# Altium project EVK-IRIS-W1-Mikro-Bus.PrjPcb (part 3 of 5)

## Sheet EVK-IRIS-W1_MikroBuses.SchDoc: Top Level Design
size A3; CompanyName: Rigado, LLC; Organization: Rigado; DocumentNumber: 10; SheetNumber: 10; SheetTotal: 14; Website: www.rigado.com; SheetSize: B
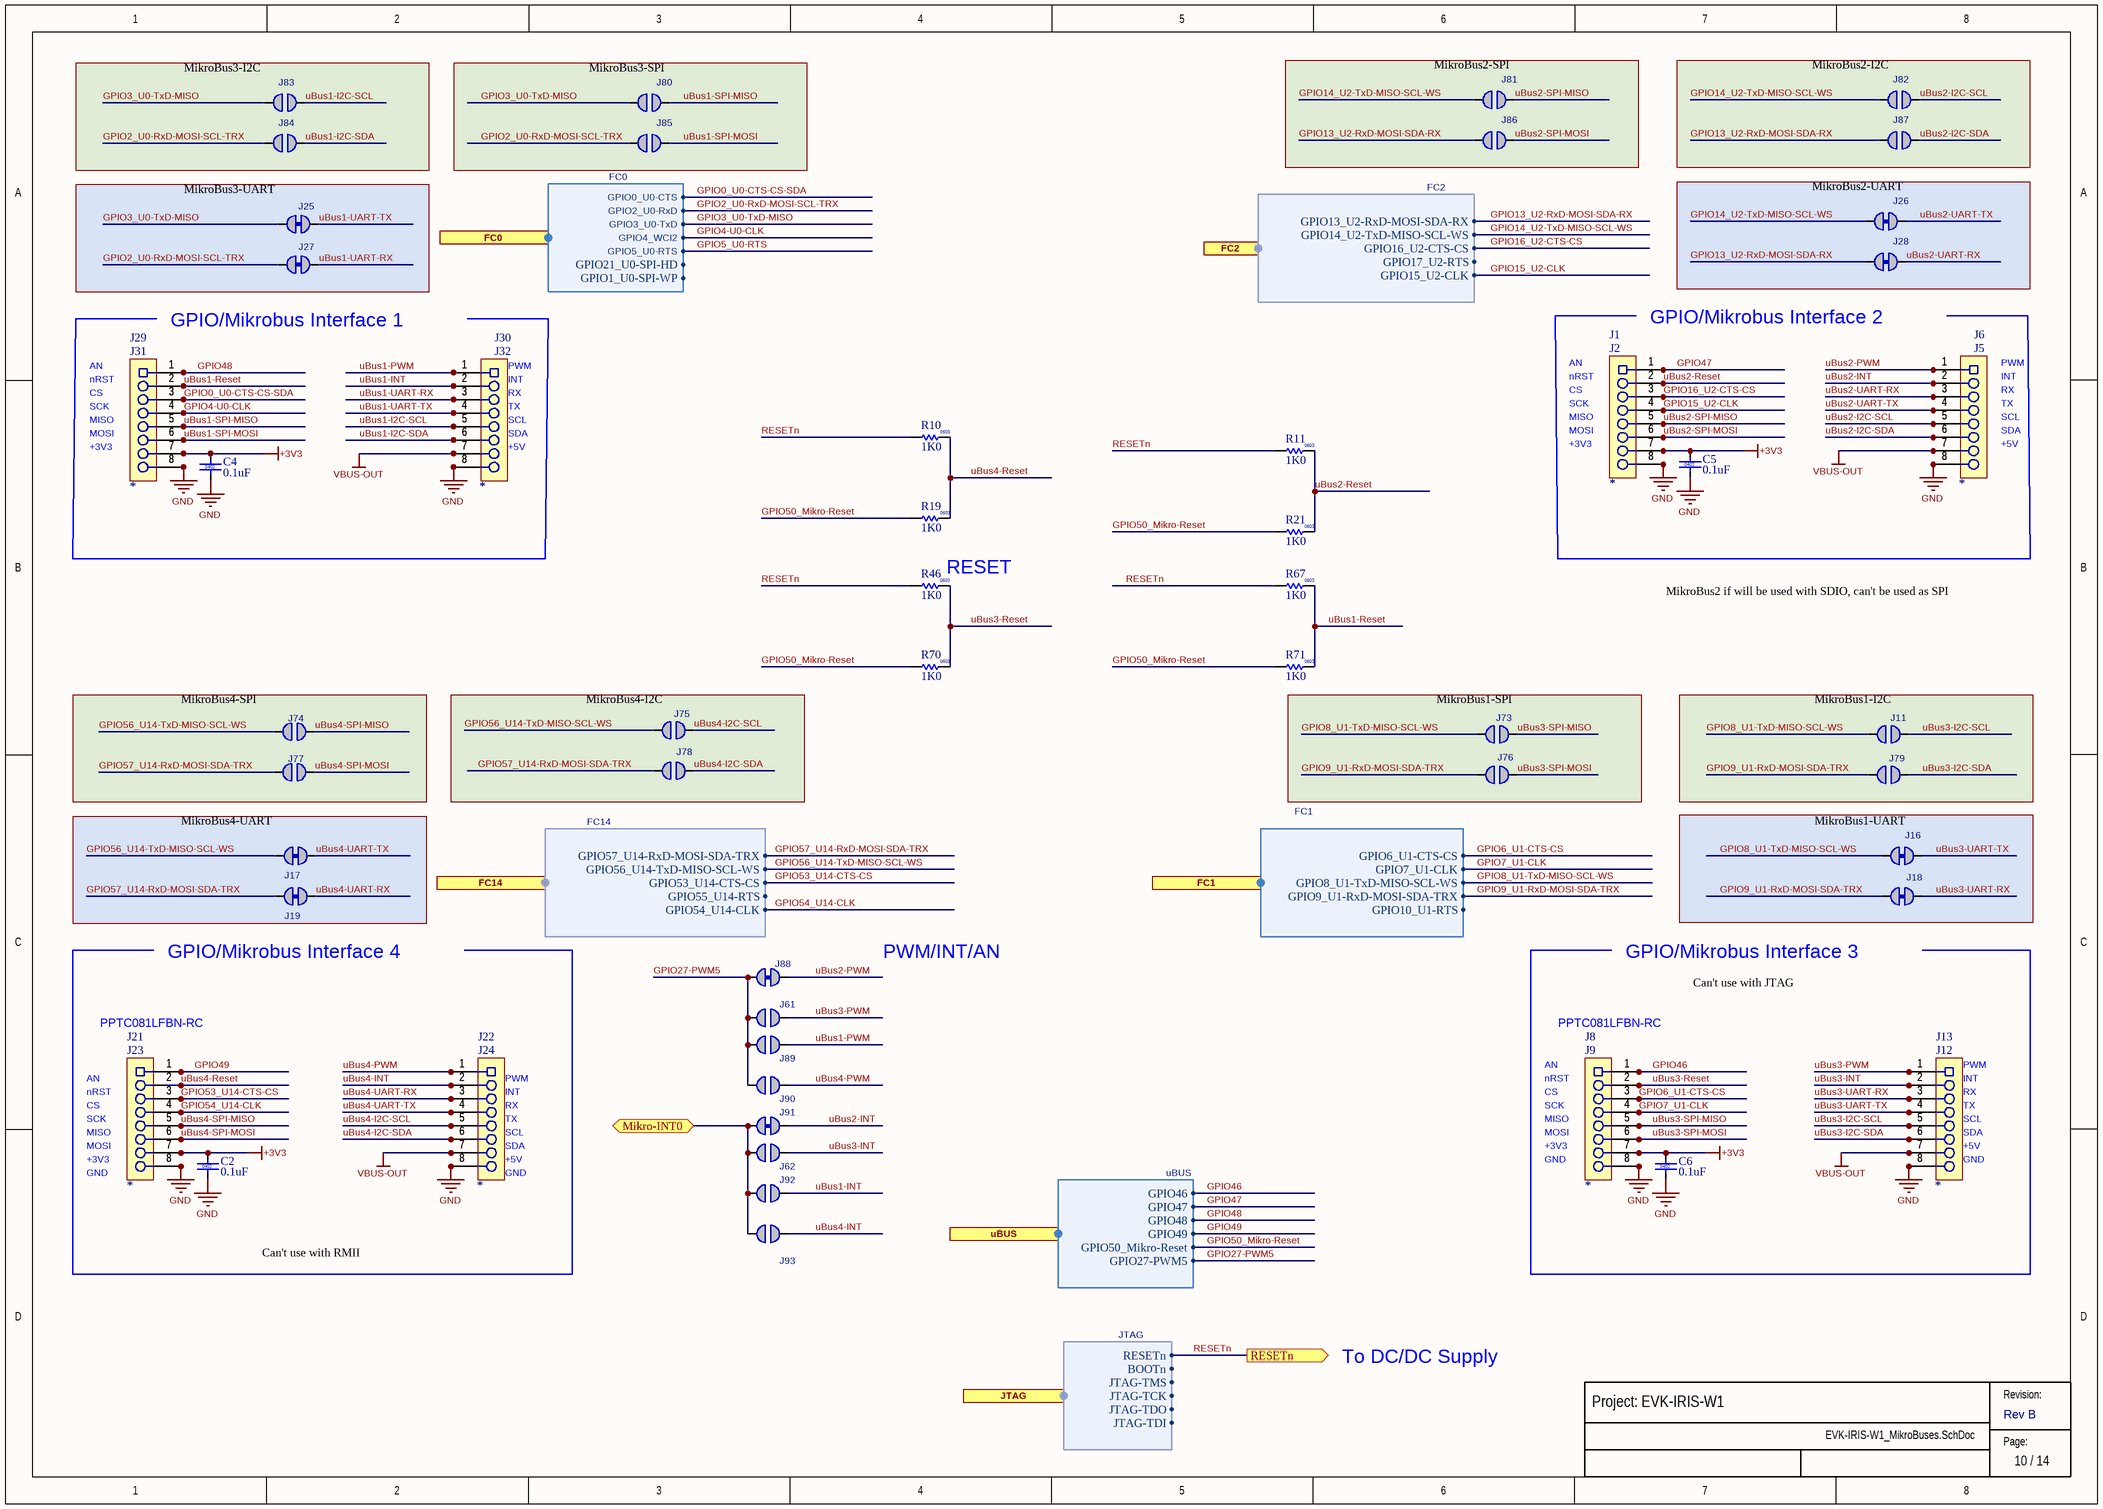
[diagram p6: EVK-IRIS-W1_MikroBuses.SchDoc]

### Parts
C2  value 0.1uF  Size: 0402  [Cap 0402 HD]
C4  value 0.1uF  Size: 0402  [Cap 0402 HD]
C5  value 0.1uF  Size: 0402  [Cap 0402 HD]
C6  value 0.1uF  Size: 0402  [Cap 0402 HD]
J1  (no value)  [SKT-0.1P-8PIN-8x1_TH]
J2  (no value)  [SKT-0.1P-8PIN-8x1_TH]
J5  (no value)  [SKT-0.1P-8PIN-8x1_TH]
J6  (no value)  [SKT-0.1P-8PIN-8x1_TH]
J8  (no value)  [SKT-0.1P-8PIN-8x1_TH]
J9  (no value)  [SKT-0.1P-8PIN-8x1_TH]
J11  Solderbridge-OpenDNP  [Solderbridge-Open]  (value not drawn)  (no BOM)
J12  (no value)  [SKT-0.1P-8PIN-8x1_TH]
J13  (no value)  [SKT-0.1P-8PIN-8x1_TH]
J16  Solderbridge-ShortDNP  [Solderbridge-Short]  (value not drawn)  (net tie, no BOM)
J17  Solderbridge-ShortDNP  [Solderbridge-Short]  (value not drawn)  (net tie, no BOM)
J18  Solderbridge-ShortDNP  [Solderbridge-Short]  (value not drawn)  (net tie, no BOM)
J19  Solderbridge-ShortDNP  [Solderbridge-Short]  (value not drawn)  (net tie, no BOM)
J21  (no value)  [SKT-0.1P-8PIN-8x1_TH]
J22  (no value)  [SKT-0.1P-8PIN-8x1_TH]
J23  (no value)  [SKT-0.1P-8PIN-8x1_TH]
J24  (no value)  [SKT-0.1P-8PIN-8x1_TH]
J25  Solderbridge-ShortDNP  [Solderbridge-Short]  (value not drawn)  (net tie, no BOM)
J26  Solderbridge-ShortDNP  [Solderbridge-Short]  (value not drawn)  (net tie, no BOM)
J27  Solderbridge-ShortDNP  [Solderbridge-Short]  (value not drawn)  (net tie, no BOM)
J28  Solderbridge-ShortDNP  [Solderbridge-Short]  (value not drawn)  (net tie, no BOM)
J29  (no value)  [SKT-0.1P-8PIN-8x1_TH]
J30  (no value)  [SKT-0.1P-8PIN-8x1_TH]
J31  (no value)  [SKT-0.1P-8PIN-8x1_TH]
J32  (no value)  [SKT-0.1P-8PIN-8x1_TH]
J61  Solderbridge-OpenDNP  [Solderbridge-Open]  (value not drawn)  (no BOM)
J62  Solderbridge-OpenDNP  [Solderbridge-Open]  (value not drawn)  (no BOM)
J73  Solderbridge-OpenDNP  [Solderbridge-Open]  (value not drawn)  (no BOM)
J74  Solderbridge-OpenDNP  [Solderbridge-Open]  (value not drawn)  (no BOM)
J75  Solderbridge-OpenDNP  [Solderbridge-Open]  (value not drawn)  (no BOM)
J76  Solderbridge-OpenDNP  [Solderbridge-Open]  (value not drawn)  (no BOM)
J77  Solderbridge-OpenDNP  [Solderbridge-Open]  (value not drawn)  (no BOM)
J78  Solderbridge-OpenDNP  [Solderbridge-Open]  (value not drawn)  (no BOM)
J79  Solderbridge-OpenDNP  [Solderbridge-Open]  (value not drawn)  (no BOM)
J80  Solderbridge-OpenDNP  [Solderbridge-Open]  (value not drawn)  (no BOM)
J81  Solderbridge-OpenDNP  [Solderbridge-Open]  (value not drawn)  (no BOM)
J82  Solderbridge-OpenDNP  [Solderbridge-Open]  (value not drawn)  (no BOM)
J83  Solderbridge-OpenDNP  [Solderbridge-Open]  (value not drawn)  (no BOM)
J84  Solderbridge-OpenDNP  [Solderbridge-Open]  (value not drawn)  (no BOM)
J85  Solderbridge-OpenDNP  [Solderbridge-Open]  (value not drawn)  (no BOM)
J86  Solderbridge-OpenDNP  [Solderbridge-Open]  (value not drawn)  (no BOM)
J87  Solderbridge-OpenDNP  [Solderbridge-Open]  (value not drawn)  (no BOM)
J88  Solderbridge-ShortDNP  [Solderbridge-Short]  (value not drawn)  (net tie, no BOM)
J89  Solderbridge-OpenDNP  [Solderbridge-Open]  (value not drawn)  (no BOM)
J90  Solderbridge-OpenDNP  [Solderbridge-Open]  (value not drawn)  (no BOM)
J91  Solderbridge-ShortDNP  [Solderbridge-Short]  (value not drawn)  (net tie, no BOM)
J92  Solderbridge-OpenDNP  [Solderbridge-Open]  (value not drawn)  (no BOM)
J93  Solderbridge-OpenDNP  [Solderbridge-Open]  (value not drawn)  (no BOM)
R10  value 1K0  Size: 0603  [RES 0603 HD]
R11  value 1K0  Size: 0603  [RES 0603 HD]
R19  value 1K0  Size: 0603  [RES 0603 HD]
R21  value 1K0  Size: 0603  [RES 0603 HD]
R46  value 1K0  Size: 0603  [RES 0603 HD]
R67  value 1K0  Size: 0603  [RES 0603 HD]
R70  value 1K0  Size: 0603  [RES 0603 HD]
R71  value 1K0  Size: 0603  [RES 0603 HD]

### Blocks framed on the sheet
MikroBus3-I2C: J83 J84
MikroBus3-SPI: J80 J85
MikroBus2-SPI: J81 J86
MikroBus2-I2C: J82 J87
MikroBus3-UART: J25 J27
MikroBus2-UART: J26 J28
MikroBus4-SPI: J74 J77
MikroBus4-I2C: J75 J78
MikroBus1-SPI: J73 J76
MikroBus1-I2C: J11 J79
MikroBus4-UART: J17 J19
MikroBus1-UART: J16 J18

### Ports
FC0 (harness FC0), FC1 (harness FC1), FC2 (harness FC2), FC14 (harness FC14), JTAG (harness JTAG), Mikro-INT0 (bidir), RESETn (out), uBUS (harness uBUS)

### Harnesses
FC0: GPIO0_U0-CTS, GPIO2_U0-RxD, GPIO3_U0-TxD, GPIO5_U0-RTS, GPIO4_WCI2, GPIO21_U0-SPI-HD, GPIO1_U0-SPI-WP
uBUS: GPIO46, GPIO47, GPIO48, GPIO49, GPIO50_Mikro-Reset, GPIO27-PWM5
FC2: GPIO13_U2-RxD-MOSI-SDA-RX, GPIO14_U2-TxD-MISO-SCL-WS, GPIO16_U2-CTS-CS, GPIO17_U2-RTS, GPIO15_U2-CLK
FC1: GPIO6_U1-CTS-CS, GPIO7_U1-CLK, GPIO8_U1-TxD-MISO-SCL-WS, GPIO9_U1-RxD-MOSI-SDA-TRX, GPIO10_U1-RTS
FC14: GPIO57_U14-RxD-MOSI-SDA-TRX, GPIO56_U14-TxD-MISO-SCL-WS, GPIO53_U14-CTS-CS, GPIO55_U14-RTS, GPIO54_U14-CLK
JTAG: JTAG-TCK, JTAG-TDI, JTAG-TDO, JTAG-TMS, BOOTn, RESETn

### Nets
+3V3: C2.2 C4.2 C5.2 C6.2 J1.7 J2.7 J8.7 J9.7 J21.7 J23.7 J29.7 J31.7
GND: C2.1 C4.1 C5.1 C6.1 J1.8 J2.8 J5.8 J6.8 J8.8 J9.8 J12.8 J13.8 J21.8 J22.8 J23.8 J24.8 J29.8 J30.8 J31.8 J32.8
VBUS-OUT: J5.7 J6.7 J12.7 J13.7 J22.7 J24.7 J30.7 J32.7
GPIO0_U0-CTS-CS-SDA: J29.3 J31.3 ; port FC0.GPIO0_U0-CTS
GPIO2_U0-RxD-MOSI-SCL-TRX: J27.1 J84.1 J85.1 ; port FC0.GPIO2_U0-RxD
GPIO3_U0-TxD-MISO: J25.1 J80.1 J83.1 ; port FC0.GPIO3_U0-TxD
GPIO4-U0-CLK: J29.4 J31.4 ; port FC0.GPIO4_WCI2
GPIO6_U1-CTS-CS: J8.3 J9.3 ; port FC1.GPIO6_U1-CTS-CS
GPIO7_U1-CLK: J8.4 J9.4 ; port FC1.GPIO7_U1-CLK
GPIO8_U1-TxD-MISO-SCL-WS: J11.1 J16.1 J73.1 ; port FC1.GPIO8_U1-TxD-MISO-SCL-WS
GPIO9_U1-RxD-MOSI-SDA-TRX: J18.1 J76.1 J79.1 ; port FC1.GPIO9_U1-RxD-MOSI-SDA-TRX
GPIO13_U2-RxD-MOSI-SDA-RX: J28.1 J86.1 J87.1 ; port FC2.GPIO13_U2-RxD-MOSI-SDA-RX
GPIO14_U2-TxD-MISO-SCL-WS: J26.1 J81.1 J82.1 ; port FC2.GPIO14_U2-TxD-MISO-SCL-WS
GPIO15_U2-CLK: J1.4 J2.4 ; port FC2.GPIO15_U2-CLK
GPIO16_U2-CTS-CS: J1.3 J2.3 ; port FC2.GPIO16_U2-CTS-CS
GPIO18__Mikro-INT0: J62.1 J91.1 J92.1 J93.1 ; port Mikro-INT0
GPIO27-PWM5: J61.1 J88.1 J89.1 J90.1 ; port uBUS.GPIO27-PWM5
GPIO46: J8.1 J9.1 ; port uBUS.GPIO46
GPIO47: J1.1 J2.1 ; port uBUS.GPIO47
GPIO48: J29.1 J31.1 ; port uBUS.GPIO48
GPIO49: J21.1 J23.1 ; port uBUS.GPIO49
GPIO50_Mikro-Reset: R19.1 R21.1 R70.1 R71.1 ; port uBUS.GPIO50_Mikro-Reset
GPIO53_U14-CTS-CS: J21.3 J23.3 ; port FC14.GPIO53_U14-CTS-CS
GPIO54_U14-CLK: J21.4 J23.4 ; port FC14.GPIO54_U14-CLK
GPIO56_U14-TxD-MISO-SCL-WS: J17.1 J74.1 J75.1 ; port FC14.GPIO56_U14-TxD-MISO-SCL-WS
GPIO57_U14-RxD-MOSI-SDA-TRX: J19.1 J77.1 J78.1 ; port FC14.GPIO57_U14-RxD-MOSI-SDA-TRX
RESETn: R10.1 R11.1 R46.1 R67.1 ; port RESETn, port JTAG.RESETn
uBus1-I2C-SCL: J30.5 J32.5 J83.2
uBus1-I2C-SDA: J30.6 J32.6 J84.2
uBus1-INT: J30.2 J32.2 J92.2
uBus1-PWM: J30.1 J32.1 J89.2
uBus1-Reset: J29.2 J31.2 R67.2 R71.2
uBus1-SPI-MISO: J29.5 J31.5 J80.2
uBus1-SPI-MOSI: J29.6 J31.6 J85.2
uBus1-UART-RX: J27.2 J30.3 J32.3
uBus1-UART-TX: J25.2 J30.4 J32.4
uBus2-I2C-SCL: J5.5 J6.5 J82.2
uBus2-I2C-SDA: J5.6 J6.6 J87.2
uBus2-INT: J5.2 J6.2 J91.2
uBus2-PWM: J5.1 J6.1 J88.2
uBus2-Reset: J1.2 J2.2 R11.2 R21.2
uBus2-SPI-MISO: J1.5 J2.5 J81.2
uBus2-SPI-MOSI: J1.6 J2.6 J86.2
uBus2-UART-RX: J5.3 J6.3 J28.2
uBus2-UART-TX: J5.4 J6.4 J26.2
uBus3-I2C-SCL: J11.2 J12.5 J13.5
uBus3-I2C-SDA: J12.6 J13.6 J79.2
uBus3-INT: J12.2 J13.2 J62.2
uBus3-PWM: J12.1 J13.1 J61.2
uBus3-Reset: J8.2 J9.2 R46.2 R70.2
uBus3-SPI-MISO: J8.5 J9.5 J73.2
uBus3-SPI-MOSI: J8.6 J9.6 J76.2
uBus3-UART-RX: J12.3 J13.3 J18.2
uBus3-UART-TX: J12.4 J13.4 J16.2
uBus4-I2C-SCL: J22.5 J24.5 J75.2
uBus4-I2C-SDA: J22.6 J24.6 J78.2
uBus4-INT: J22.2 J24.2 J93.2
uBus4-PWM: J22.1 J24.1 J90.2
uBus4-Reset: J21.2 J23.2 R10.2 R19.2
uBus4-SPI-MISO: J21.5 J23.5 J74.2
uBus4-SPI-MOSI: J21.6 J23.6 J77.2
uBus4-UART-RX: J19.2 J22.3 J24.3
uBus4-UART-TX: J17.2 J22.4 J24.4

### Notes on the sheet
- AN
- nRST
- GPIO/Mikrobus Interface 1
- PWM
- INT
- GPIO/Mikrobus Interface 2
- CS
- SCK
- MISO
- MOSI
- +3V3
- RX
- TX
- SCL
- SDA
- +5V
- (near R46) RESET
- MikroBus2 if will be used with SDIO, can't be used as SPI
- (near J19) GPIO/Mikrobus Interface 4
- PWM/INT/AN
- (near J18) GPIO/Mikrobus Interface 3
- Can't use with JTAG
- PPTC081LFBN-RC
- GND
- Can't use with RMII
- To DC/DC Supply
- Revision:
- Page:

### Library data of the parts
C2 C4-C6 = 120-00016: Cap, Ceramic 0.1uF 10V 10% X5R 0402; Part Name: CAP CER 0.1UF 10V 10% X5R 0402; Manufacturer 1: Murata Electronics North America; Manufacturer Part Number 1: GRM155R61A104KA01J; Tolerance: +/- 10%; Use in new designs: Yes; Item Phase: In Production; UBX Code: None; Part Number: 120-00016; Revision: 0A; Manufacturer 2: Yageo; Height: 0.55mm; Pins: 2; Temperature Coefficient: X5R; Voltage: 10V; Max Operating Temp: 85; Min Operating Temp: -55; Supplier 1: Digi-Key; Supplier Part Number 1: 490-6297-1-ND; Manufacturer Part Number 2: CC0402KRX5R6BB104; Supplier 2: Digi-Key; Supplier Part Number 2: 311-1336-1-ND
J1 J2 J5 J6 J8 J9 J12 J13 J21-J24 J29-J32 = PPTC081LFBN-RC: Socket, 0.100" Pitch, 8 Pin, Vert TH, Black; Manufacturer 1: Samtec Inc.; Part Name: CON HDR 0.1" 8 Pin 1 Row TH Vert; Item Phase: In Production; Use in new designs: Yes; Voltage: None; Part Number: PPTC081LFBN-RC; Manufacturer Part Number 1: PPTC081LFBN-RC; Supplier 1: None; Supplier Part Number 1: None; Diameter: None; Max Operating Temp: None; Min Operating Temp: None; Pins: 8; Revision: 0A; UBX Code: None; Manufacturer 2: None; Manufacturer Part Number 2: None; Supplier 2: None; Supplier Part Number 2: None; Manufacturer P/N: *
J11 J61 J62 J73-J87 J89 J90 J92 J93 = Solderbridge-Open: Added By: Paul B; Part Number: Solderbridge-Open; Height: 0; DNP: DNP; Added Date: 12/2/2015
J16-J19 J25-J28 J88 J91 = Solderbridge-Short: Added By: Paul B; Part Number: Solderbridge-Short; Height: 0; DNP: DNP; Added Date: 12/2/2015
R10 R11 R19 R21 R46 R67 R70 R71 = UBXH18-0000400: RES THICK FILM CHIP 0603 25PPM 1K0 0.1% 100mW; Manufacturer: YAGEO; Manufacturer P/N: RT0603BRD071KL; Editor: martin.kessel; Env: ROHS; Permitted Use: Internal Use; Perferred: PREF; Mfg P/N Status: Active; Mfg P/N Split: 100; Mfg P/N Released: No; Part Number: UBXH18-0000400; Tolerance: 0.1%; Max Power: 100mW; Part Type: Resistor; UBX Wiki: https://wiki.u-blox.com/bin/view/Operations/PartDetails?index=27323; RefDes: R; Min Operating Temp: -55°C; Max Operating Temp: 155°C

## Sheet EVK-IRIS-W1_MOD.SchDoc
size A3; DocumentNumber: 2; SheetNumber: 2; SheetTotal: 14
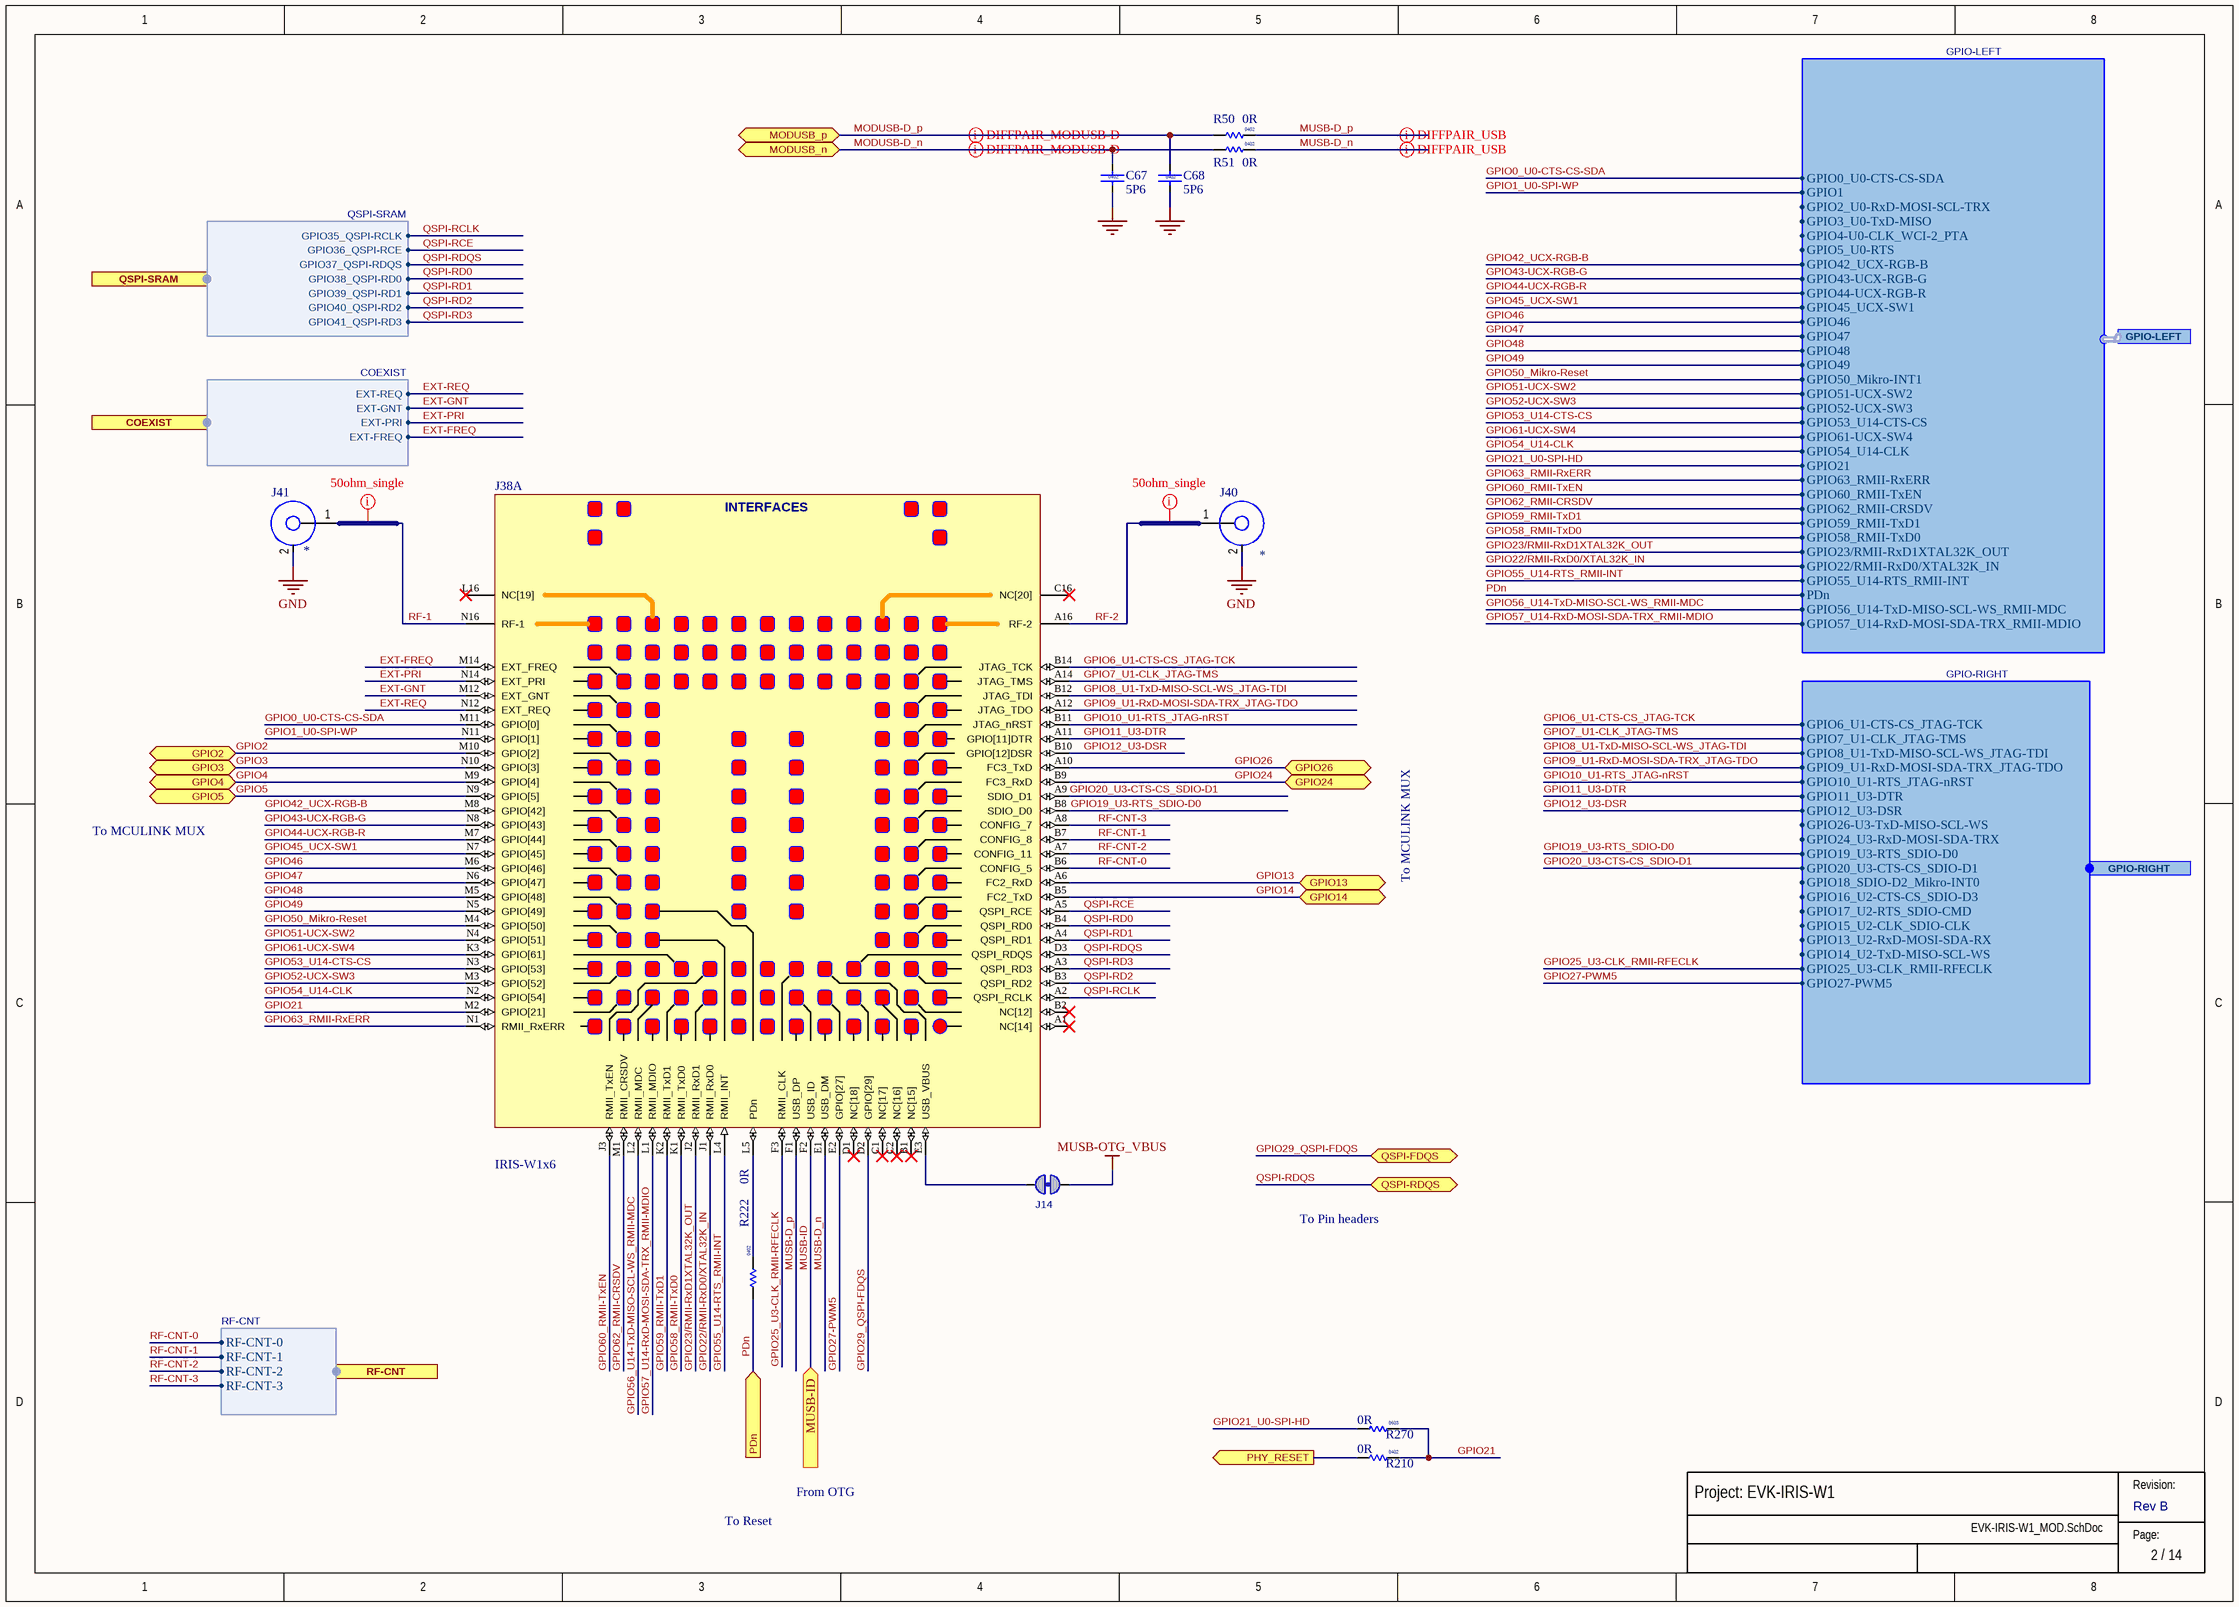
[diagram p7: EVK-IRIS-W1_MOD.SchDoc]

### Parts
C67  value 5P6  Size: 0402  [Cap 0402]
C68  value 5P6  Size: 0402  [Cap 0402]
J14  Solderbridge-ShortDNP  [Solderbridge-Short]  (value not drawn)  (net tie, no BOM)
J38  IRIS-W1x6  [IRIS-W1x6_LGA152]  (part A of 2)
J40  (no value)  [U.FL_3Pin]
J41  (no value)  [U.FL_3Pin]
R50  value 0R  Size: 0402  [RES 0402 HD]
R51  value 0R  Size: 0402  [RES 0402 HD]
R210  value 0R  Size: 0402  [RES 0402 HD]
R222  value 0R  Size: 0402  [RES 0402 HD]
R270  value 0R  Size: 0603  [RES 0603 HD]

### Ports
COEXIST (harness COEXIST), GPIO2 (bidir), GPIO3 (bidir), GPIO4 (bidir), GPIO5 (bidir), GPIO13 (bidir), GPIO14 (bidir), GPIO24 (bidir), GPIO26 (bidir), GPIO-LEFT (harness GPIO-LEFT), GPIO-RIGHT (harness GPIO-RIGHT), MODUSB_n (bidir), MODUSB_p (bidir), MUSB-ID (in), PDn (in), PHY_RESET (out), QSPI-FDQS (bidir), QSPI-RDQS (bidir), QSPI-SRAM (harness QSPI-SRAM), RF-CNT (harness RF-CNT)

### Harnesses
QSPI-SRAM: GPIO35_QSPI-RCLK, GPIO36_QSPI-RCE, GPIO37_QSPI-RDQS, GPIO38_QSPI-RD0, GPIO39_QSPI-RD1, GPIO40_QSPI-RD2, GPIO41_QSPI-RD3
COEXIST: EXT-REQ, EXT-GNT, EXT-PRI, EXT-FREQ
GPIO-RIGHT: GPIO6_U1-CTS-CS_JTAG-TCK, GPIO7_U1-CLK_JTAG-TMS, GPIO8_U1-TxD-MISO-SCL-WS_JTAG-TDI, GPIO9_U1-RxD-MOSI-SDA-TRX_JTAG-TDO, GPIO10_U1-RTS_JTAG-nRST, GPIO11_U3-DTR, GPIO12_U3-DSR, GPIO26-U3-TxD-MISO-SCL-WS, GPIO24_U3-RxD-MOSI-SDA-TRX, GPIO19_U3-RTS_SDIO-D0, GPIO20_U3-CTS-CS_SDIO-D1, GPIO18_SDIO-D2_Mikro-INT0, GPIO16_U2-CTS-CS_SDIO-D3, GPIO17_U2-RTS_SDIO-CMD, GPIO15_U2-CLK_SDIO-CLK, GPIO13_U2-RxD-MOSI-SDA-RX, GPIO14_U2-TxD-MISO-SCL-WS, GPIO25_U3-CLK_RMII-RFECLK, GPIO27-PWM5
GPIO-LEFT: GPIO0_U0-CTS-CS-SDA, GPIO1, GPIO2_U0-RxD-MOSI-SCL-TRX, GPIO3_U0-TxD-MISO, GPIO4-U0-CLK_WCI-2_PTA, GPIO5_U0-RTS, GPIO42_UCX-RGB-B, GPIO43-UCX-RGB-G, GPIO44-UCX-RGB-R, GPIO45_UCX-SW1, GPIO46, GPIO47, GPIO48, GPIO49, GPIO50_Mikro-INT1, GPIO51-UCX-SW2, GPIO52-UCX-SW3, GPIO53_U14-CTS-CS, GPIO61-UCX-SW4, GPIO54_U14-CLK, GPIO21, GPIO63_RMII-RxERR, GPIO60_RMII-TxEN, GPIO62_RMII-CRSDV, GPIO59_RMII-TxD1, GPIO58_RMII-TxD0, GPIO23/RMII-RxD1XTAL32K_OUT, GPIO22/RMII-RxD0/XTAL32K_IN, GPIO55_U14-RTS_RMII-INT, PDn, GPIO56_U14-TxD-MISO-SCL-WS_RMII-MDC, GPIO57_U14-RxD-MOSI-SDA-TRX_RMII-MDIO
RF-CNT: RF-CNT-0, RF-CNT-1, RF-CNT-2, RF-CNT-3

### Nets
GND: C67.2 C68.2 J40.2 J41.2
MUSB-OTG_VBUS: J14.2
EXT-FREQ: J38.M14(EXT_FREQ) ; port COEXIST.EXT-FREQ
EXT-GNT: J38.M12(EXT_GNT) ; port COEXIST.EXT-GNT
EXT-PRI: J38.N14(EXT_PRI) ; port COEXIST.EXT-PRI
EXT-REQ: J38.N12(EXT_REQ) ; port COEXIST.EXT-REQ
GPIO0_U0-CTS-CS-SDA: J38.M11(GPIO[0]) ; port GPIO-LEFT.GPIO0_U0-CTS-CS-SDA
GPIO1_U0-SPI-WP: J38.N11(GPIO[1]) ; port GPIO-LEFT.GPIO1
GPIO2: J38.M10(GPIO[2]) ; port GPIO2
GPIO3: J38.N10(GPIO[3]) ; port GPIO3
GPIO4: J38.M9(GPIO[4]) ; port GPIO4
GPIO5: J38.N9(GPIO[5]) ; port GPIO5
GPIO6_U1-CTS-CS_JTAG-TCK: J38.B14(JTAG_TCK) ; port GPIO-RIGHT.GPIO6_U1-CTS-CS_JTAG-TCK
GPIO7_U1-CLK_JTAG-TMS: J38.A14(JTAG_TMS) ; port GPIO-RIGHT.GPIO7_U1-CLK_JTAG-TMS
GPIO8_U1-TxD-MISO-SCL-WS_JTAG-TDI: J38.B12(JTAG_TDI) ; port GPIO-RIGHT.GPIO8_U1-TxD-MISO-SCL-WS_JTAG-TDI
GPIO9_U1-RxD-MOSI-SDA-TRX_JTAG-TDO: J38.A12(JTAG_TDO) ; port GPIO-RIGHT.GPIO9_U1-RxD-MOSI-SDA-TRX_JTAG-TDO
GPIO10_U1-RTS_JTAG-nRST: J38.B11(JTAG_nRST) ; port GPIO-RIGHT.GPIO10_U1-RTS_JTAG-nRST
GPIO11_U3-DTR: J38.A11(GPIO[11]DTR) ; port GPIO-RIGHT.GPIO11_U3-DTR
GPIO12_U3-DSR: J38.B10(GPIO[12]DSR) ; port GPIO-RIGHT.GPIO12_U3-DSR
GPIO13: J38.A6(FC2_RxD) ; port GPIO13
GPIO14: J38.B5(FC2_TxD) ; port GPIO14
GPIO19_U3-RTS_SDIO-D0: J38.B8(SDIO_D0) ; port GPIO-RIGHT.GPIO19_U3-RTS_SDIO-D0
GPIO20_U3-CTS-CS_SDIO-D1: J38.A9(SDIO_D1) ; port GPIO-RIGHT.GPIO20_U3-CTS-CS_SDIO-D1
GPIO21: J38.M2(GPIO[21]) R210.2 R270.2
GPIO21_U0-SPI-HD: R270.1 ; port GPIO-LEFT.GPIO21
GPIO22/RMII-RxD0/XTAL32K_IN: J38.J1(RMII_RxD0) ; port GPIO-LEFT.GPIO22/RMII-RxD0/XTAL32K_IN
GPIO23/RMII-RxD1XTAL32K_OUT: J38.J2(RMII_RxD1) ; port GPIO-LEFT.GPIO23/RMII-RxD1XTAL32K_OUT
GPIO24: J38.B9(FC3_RxD) ; port GPIO24
GPIO25_U3-CLK_RMII-RFECLK: J38.F3(RMII_CLK) ; port GPIO-RIGHT.GPIO25_U3-CLK_RMII-RFECLK
GPIO26: J38.A10(FC3_TxD) ; port GPIO26
GPIO27-PWM5: J38.E2(GPIO[27]) ; port GPIO-RIGHT.GPIO27-PWM5
GPIO29_QSPI-FDQS: J38.D2(GPIO[29]) ; port QSPI-FDQS
GPIO42_UCX-RGB-B: J38.M8(GPIO[42]) ; port GPIO-LEFT.GPIO42_UCX-RGB-B
GPIO43-UCX-RGB-G: J38.N8(GPIO[43]) ; port GPIO-LEFT.GPIO43-UCX-RGB-G
GPIO44-UCX-RGB-R: J38.M7(GPIO[44]) ; port GPIO-LEFT.GPIO44-UCX-RGB-R
GPIO45_UCX-SW1: J38.N7(GPIO[45]) ; port GPIO-LEFT.GPIO45_UCX-SW1
GPIO46: J38.M6(GPIO[46]) ; port GPIO-LEFT.GPIO46
GPIO47: J38.N6(GPIO[47]) ; port GPIO-LEFT.GPIO47
GPIO48: J38.M5(GPIO[48]) ; port GPIO-LEFT.GPIO48
GPIO49: J38.N5(GPIO[49]) ; port GPIO-LEFT.GPIO49
GPIO50_Mikro-Reset: J38.M4(GPIO[50]) ; port GPIO-LEFT.GPIO50_Mikro-INT1
GPIO51-UCX-SW2: J38.N4(GPIO[51]) ; port GPIO-LEFT.GPIO51-UCX-SW2
GPIO52-UCX-SW3: J38.M3(GPIO[52]) ; port GPIO-LEFT.GPIO52-UCX-SW3
GPIO53_U14-CTS-CS: J38.N3(GPIO[53]) ; port GPIO-LEFT.GPIO53_U14-CTS-CS
GPIO54_U14-CLK: J38.N2(GPIO[54]) ; port GPIO-LEFT.GPIO54_U14-CLK
GPIO55_U14-RTS_RMII-INT: J38.L4(RMII_INT) ; port GPIO-LEFT.GPIO55_U14-RTS_RMII-INT
GPIO56_U14-TxD-MISO-SCL-WS_RMII-MDC: J38.L2(RMII_MDC) ; port GPIO-LEFT.GPIO56_U14-TxD-MISO-SCL-WS_RMII-MDC
GPIO57_U14-RxD-MOSI-SDA-TRX_RMII-MDIO: J38.L1(RMII_MDIO) ; port GPIO-LEFT.GPIO57_U14-RxD-MOSI-SDA-TRX_RMII-MDIO
GPIO58_RMII-TxD0: J38.K1(RMII_TxD0) ; port GPIO-LEFT.GPIO58_RMII-TxD0
GPIO59_RMII-TxD1: J38.K2(RMII_TxD1) ; port GPIO-LEFT.GPIO59_RMII-TxD1
GPIO60_RMII-TxEN: J38.J3(RMII_TxEN) ; port GPIO-LEFT.GPIO60_RMII-TxEN
GPIO61-UCX-SW4: J38.K3(GPIO[61]) ; port GPIO-LEFT.GPIO61-UCX-SW4
GPIO62_RMII-CRSDV: J38.M1(RMII_CRSDV) ; port GPIO-LEFT.GPIO62_RMII-CRSDV
GPIO63_RMII-RxERR: J38.N1(RMII_RxERR) ; port GPIO-LEFT.GPIO63_RMII-RxERR
MODUSB-D_n: C67.1 R51.1 ; port MODUSB_n
MODUSB-D_p: C68.1 R50.1 ; port MODUSB_p
MUSB-D_n: J38.E1(USB_DM) R51.2
MUSB-D_p: J38.F1(USB_DP) R50.2
MUSB-ID: J38.F2(USB_ID) ; port MUSB-ID
PDn: R222.1 ; port PDn, port GPIO-LEFT.PDn
PHY_RESET: R210.1 ; port PHY_RESET
QSPI-RCE: J38.A5(QSPI_RCE) ; port QSPI-SRAM.GPIO36_QSPI-RCE
QSPI-RCLK: J38.A2(QSPI_RCLK) ; port QSPI-SRAM.GPIO35_QSPI-RCLK
QSPI-RD0: J38.B4(QSPI_RD0) ; port QSPI-SRAM.GPIO38_QSPI-RD0
QSPI-RD1: J38.A4(QSPI_RD1) ; port QSPI-SRAM.GPIO39_QSPI-RD1
QSPI-RD2: J38.B3(QSPI_RD2) ; port QSPI-SRAM.GPIO40_QSPI-RD2
QSPI-RD3: J38.A3(QSPI_RD3) ; port QSPI-SRAM.GPIO41_QSPI-RD3
QSPI-RDQS: J38.D3(QSPI_RDQS) ; port QSPI-RDQS, port QSPI-SRAM.GPIO37_QSPI-RDQS
RF-1: J38.N16(RF-1) J41.1(ANT)
RF-2: J38.A16(RF-2) J40.1(ANT)
RF-CNT-0: J38.B6(CONFIG_5) ; port RF-CNT.RF-CNT-0
RF-CNT-1: J38.B7(CONFIG_8) ; port RF-CNT.RF-CNT-1
RF-CNT-2: J38.A7(CONFIG_11) ; port RF-CNT.RF-CNT-2
RF-CNT-3: J38.A8(CONFIG_7) ; port RF-CNT.RF-CNT-3
NetJ14_1: J14.1 J38.E3(USB_VBUS)
NetJ38_L5: J38.L5(PDn) R222.2

Not connected (* = marked no-connect by the designer): J38 A1(NC[14])* B1(NC[15])* B2(NC[12])* C1(NC[17])* C2(NC[16])* C16(NC[20])* D1(NC[18])* L16(NC[19])*

### Layout directives
differential pair; differential pair class USB_DIFF; net class USB_DIFF: MODUSB-D_n, MODUSB-D_p, MUSB-D_n, MUSB-D_p
net class 50_ohm_se: RF-1, RF-2

### Notes on the sheet
- To MCULINK MUX
- To Pin headers
- To Reset
- From OTG
- Revision:
- Page:
- (in symbol UBXH14-0000681, part A) INTERFACES

### Library data of the parts
C67 C68 = UBXH01-0004011: CAP CER C0G 0402 5P6 +/-0.25P 25V; Manufacturer: Murata Manufacturing Company, Ltd.; Manufacturer P/N: GRM1555C1H5R6CZ01; Editor: roland.rust; Env: ROHS; Permitted Use: Volume Products; Perferred: PREF; Mfg P/N Status: Obsolete; Mfg P/N Split: 0; Part Number: UBXH01-0004011; Tolerance: +/-0.25P; Max Voltage: 25V; Part Type: Capacitor; Released by: roland.rust; Release Data: 2007-10-22T12:46:36; UBX Wiki: https://wiki.u-blox.com/bin/view/Operations/PartDetails?index=5160; RefDes: C; Mfg P/N Released: Obsolete; Manufacturer 2: Murata Manufacturing Company, Ltd.; Manufacturer P/N 2: GRM1555C1E5R6CZ01; Mfg P/N Status 2: Obsolete; Mfg P/N Split 2: 0; Mfg P/N Released 2: Obsolete
J14 = Solderbridge-Short: Added By: Paul B; Part Number: Solderbridge-Short; Height: 0; DNP: DNP; Added Date: 12/2/2015
J38 = UBXH14-0000681: SHORT RANGE STAND-ALONE MULTIRADIO MODULE U-BLOX IRIS-W106; Editor: olof.viklund; Env: ROHS; Permitted Use: Volume Products; Perferred: PREF; Part Number: UBXH14-0000681; Min Operating Temp: -40°C; Max Operating Temp: 85°C; Part Type: RF; UBX Wiki: https://wiki.u-blox.com/bin/view/Operations/PartDetails?index=38240; RefDes: A
J40 J41 = 130-00067: U.FL jack, SMA 50 ohm, 3 pin, SMT; Part Name: CON RF UMC U.FL Jack 3Pin SMT; Manufacturer 1: Hirose Electric Co Ltd; Manufacturer Part Number 1: U.FL-R-SMT(10); Use in new designs: Yes; UBX Code: UBXH04-0001026; Voltage: None; Item Phase: In Production; Manufacturer P/N: *; Part Number: 130-00067; Revision: 0A; Supplier 1: Digi-Key; Supplier Part Number 1: H9161CT-ND; Manufacturer 2: Dongguan Qintai Electronics Co, Ltd.; Supplier 2: Rayson Technology co., ltd; Supplier Part Number 2: MHF-RT-1; Height: 1.25mm; Pins: 3; Max Operating Temp: 90; Diameter: None; Min Operating Temp: -40; Manufacturer Part Number 2: MHF-RT-1
R50 R51 R210 R222 = UBXH18-0003002: RES THICK FILM CHIP 0402 0R 0 100mW; Manufacturer: KOA; Manufacturer P/N: RK73Z1ETTD; Tolerance: 0; Editor: charlotte.biber; Released by: peter.mueller; Env: ROHS; Permitted Use: Volume Products; Perferred: PREF; Mfg P/N Status: NRND; Mfg P/N Split: 100; Mfg P/N Released: Yes; Part Number: UBXH18-0003002; Max Power: 100mW; Part Type: Resistor; Release Data: 2012-06-05T09:49:55; UBX Wiki: https://wiki.u-blox.com/bin/view/Operations/PartDetails?index=6611; RefDes: R; Manufacturer 2: YAGEO; Manufacturer P/N 2: 2322_705_91001_L; Mfg P/N Status 2: NRND; Mfg P/N Split 2: 0; Mfg P/N Released 2: Yes
R270 = UBXH18-0003001: RES THICK FILM CHIP 0603 0R 0 100mW; Manufacturer: YAGEO; Manufacturer P/N: RC0603JR-070RL; Tolerance: 0; Editor: martin.frauchiger; Env: ROHS; Permitted Use: Volume Products; Perferred: PREF; Mfg P/N Status: Active; Mfg P/N Split: 100; Mfg P/N Released: Yes; Part Number: UBXH18-0003001; Max Power: 100mW; Part Type: Resistor; Released by: martin.frauchiger; Release Data: 2005-07-14T10:55:51; UBX Wiki: https://wiki.u-blox.com/bin/view/Operations/PartDetails?index=6609; RefDes: R

## Sheet EVK-IRIS-W1-RMII.SchDoc
size A3; DocumentNumber: 12; SheetNumber: 12; SheetTotal: 14
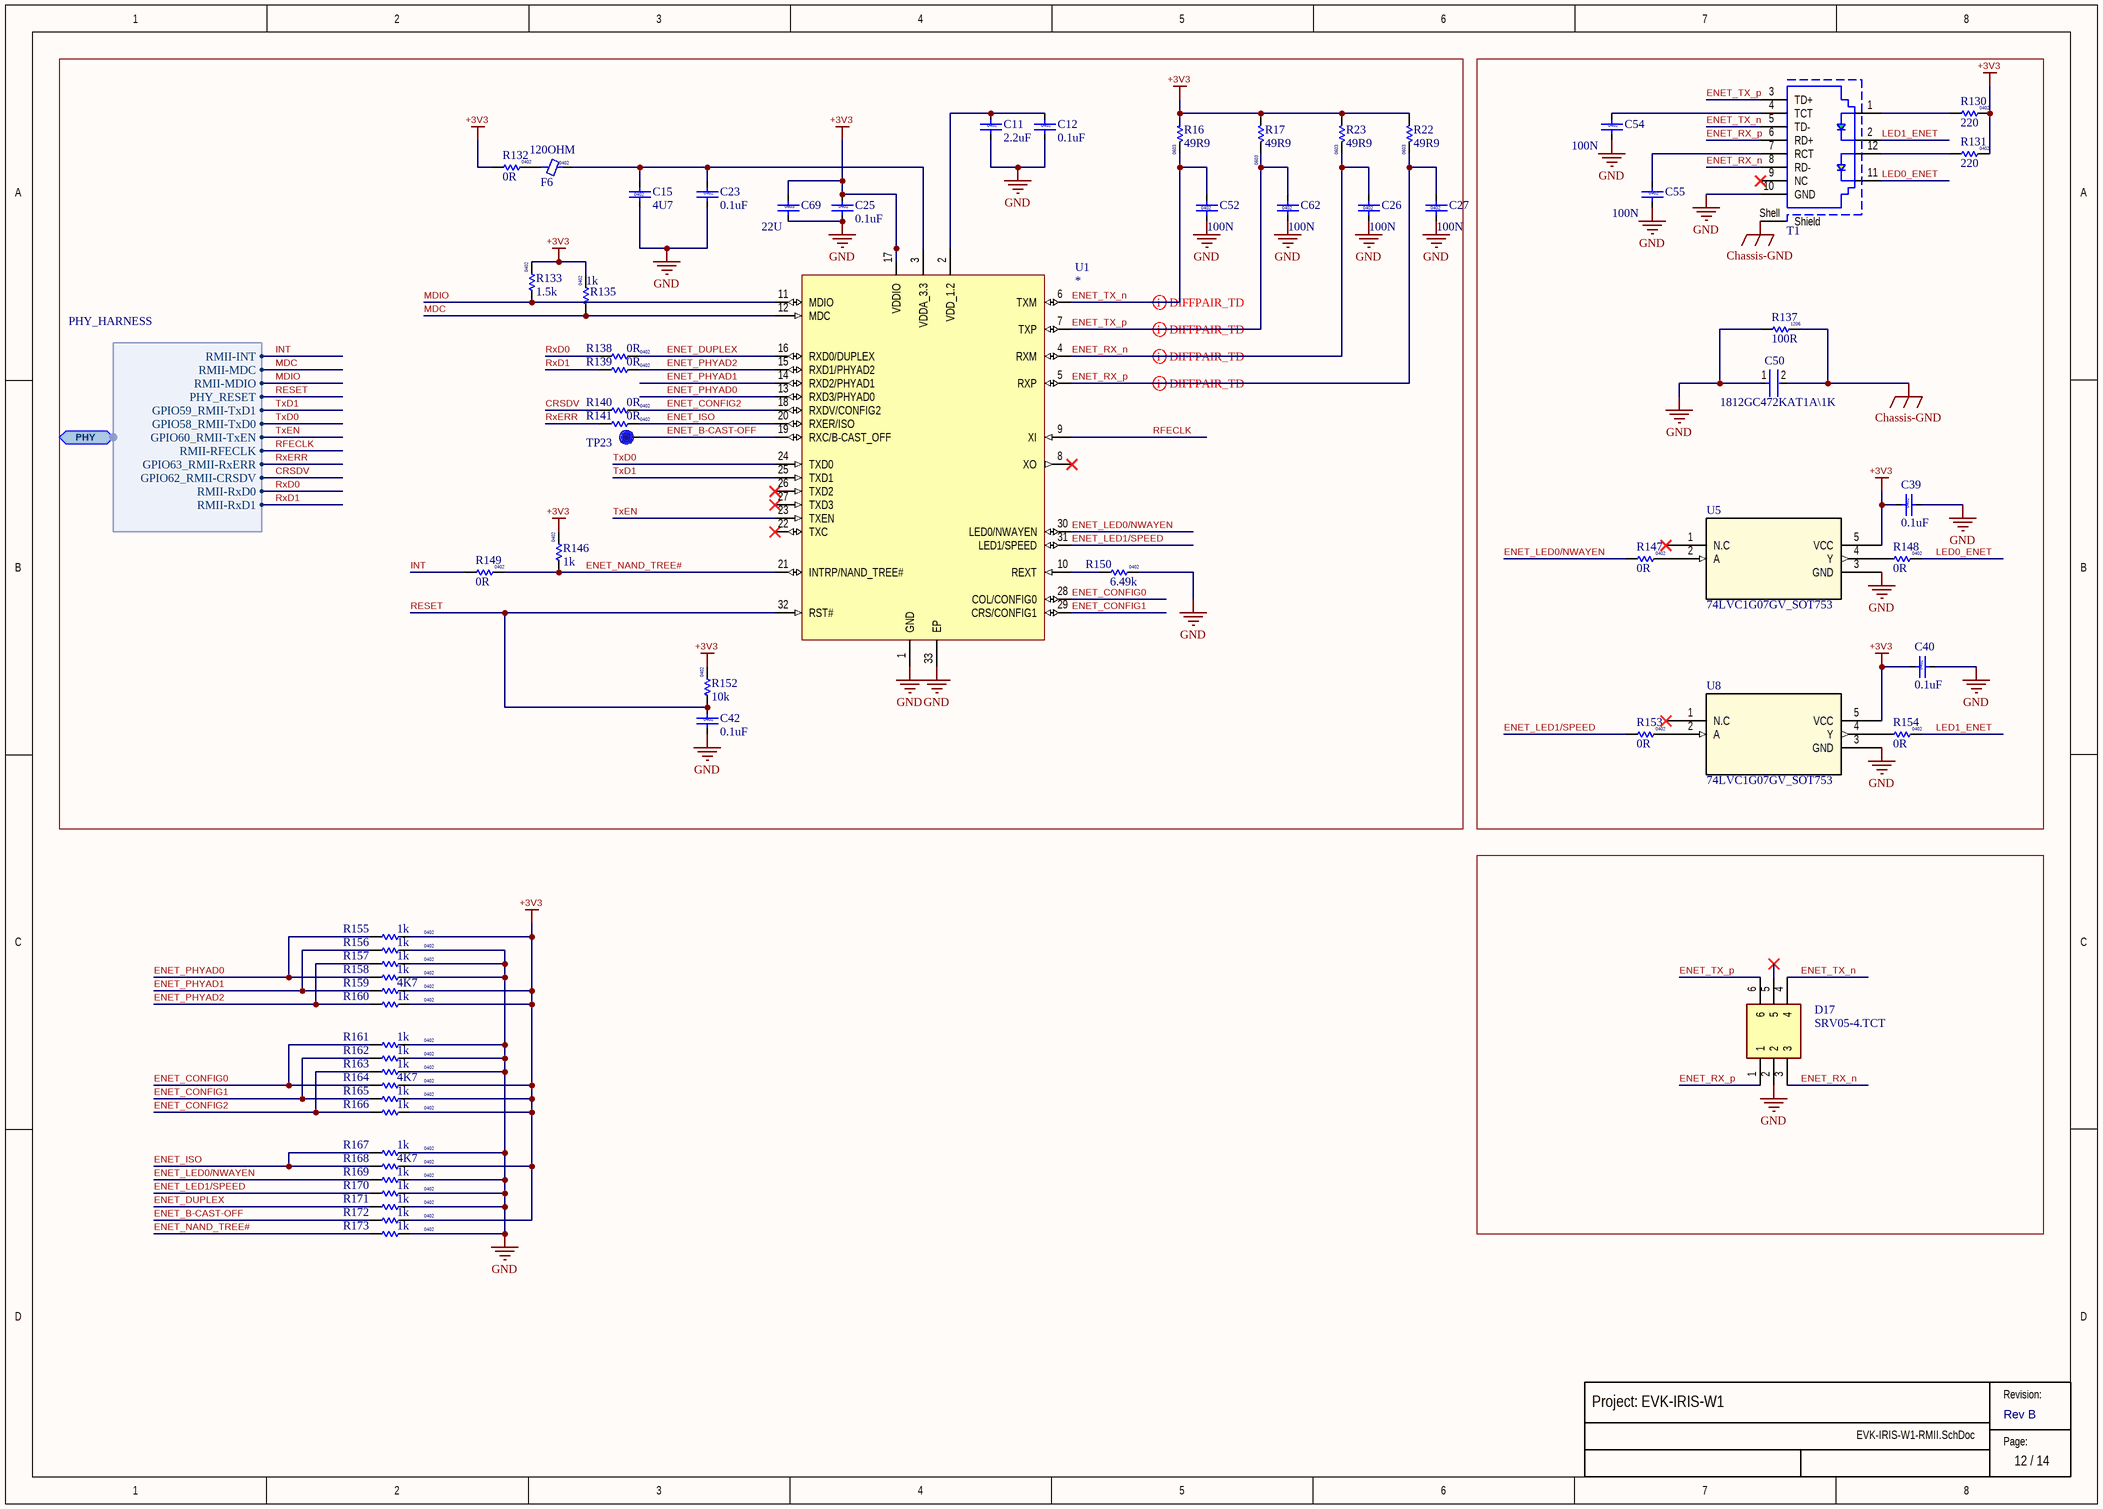
[diagram p8: EVK-IRIS-W1-RMII.SchDoc]

### Parts
C11  value 2.2uF  Size: 0402  [Cap 0402 HD]
C12  value 0.1uF  Size: 0402  [Cap 0402 HD]
C15  value 4U7  Size: 0402  [Cap_0402_1200Lx700Wx700H_600x600Pad_350G_FLX]
C23  value 0.1uF  Size: 0402  [Cap 0402 HD]
C25  value 0.1uF  Size: 0402  [Cap 0402 HD]
C26  value 100N  Size: 0402  [Cap 0402 HD]
C27  value 100N  Size: 0402  [Cap 0402 HD]
C39  value 0.1uF  Size: 0402  [Cap 0402 HD]
C40  value 0.1uF  Size: 0402  [Cap 0402 HD]
C42  value 0.1uF  Size: 0402  [Cap 0402 HD]
C50  1812GC472KAT1A\1K  [FP-1812-L_4_6_0_5-W_3_2_0-MFG]
C52  value 100N  Size: 0402  [CAP 0402]
C54  value 100N  Size: 0402  [Cap 0402]
C55  value 100N  Size: 0402  [Cap 0402]
C62  value 100N  Size: 0402  [CAP 0402]
C69  value 22U  Size: 0603  [cap 0603]
D17  SRV05-4.TCT  [SOT95P280X145-6N]
F6  value 120OHM  Size: 0402  [IND 0402]
R16  value 49R9  Size: 0603  [RES 0603 HD]
R17  value 49R9  Size: 0603  [RES 0603 HD]
R22  value 49R9  Size: 0603  [RES 0603 HD]
R23  value 49R9  Size: 0603  [RES 0603 HD]
R130  value 220  Size: 0402  [RES 0402 HD]
R131  value 220  Size: 0402  [RES 0402 HD]
R132  value 0R  Size: 0402  [RES 0402 HD]
R133  value 1.5k  Size: 0402  [RES 0402 HD]
R135  value 1k  Size: 0402  [RES 0402 HD]
R137  value 100R  Size: 1206  [RES 1206]
R138  value 0R  Size: 0402  [RES 0402 HD]
R139  value 0R  Size: 0402  [RES 0402 HD]
R140  value 0R  Size: 0402  [RES 0402 HD]
R141  value 0R  Size: 0402  [RES 0402 HD]
R146  value 1k  Size: 0402  [RES 0402 HD]
R147  value 0R  Size: 0402  [RES 0402 HD]
R148  value 0R  Size: 0402  [RES 0402 HD]
R149  value 0R  Size: 0402  [RES 0402 HD]
R150  value 6.49k  Size: 0402  [RES 0402 HD]
R152  value 10k  Size: 0402  [RES 0402 HD]
R153  value 0R  Size: 0402  [RES 0402 HD]
R154  value 0R  Size: 0402  [RES 0402 HD]
R155  value 1k  Size: 0402  [RES 0402 HD]
R156  value 1k  Size: 0402  [RES 0402 HD]
R157  value 1k  Size: 0402  [RES 0402 HD]
R158  value 1k  Size: 0402  [RES 0402 HD]
R159  value 4K7  Size: 0402  [RES 0402 HD]
R160  value 1k  Size: 0402  [RES 0402 HD]
R161  value 1k  Size: 0402  [RES 0402 HD]
R162  value 1k  Size: 0402  [RES 0402 HD]
R163  value 1k  Size: 0402  [RES 0402 HD]
R164  value 4K7  Size: 0402  [RES 0402 HD]
R165  value 1k  Size: 0402  [RES 0402 HD]
R166  value 1k  Size: 0402  [RES 0402 HD]
R167  value 1k  Size: 0402  [RES 0402 HD]
R168  value 4K7  Size: 0402  [RES 0402 HD]
R169  value 1k  Size: 0402  [RES 0402 HD]
R170  value 1k  Size: 0402  [RES 0402 HD]
R171  value 1k  Size: 0402  [RES 0402 HD]
R172  value 1k  Size: 0402  [RES 0402 HD]
R173  value 1k  Size: 0402  [RES 0402 HD]
T1  74980111211  [74980111211]  (value not drawn)
TP23  TP  [TP10R]  (value not drawn)
U1  (no value)  [QFN0.5P8x8-32Pin_W-Pad]
U5  74LVC1G07GV_SOT753  [sot-753]
U8  74LVC1G07GV_SOT753  [sot-753]

### Ports
PHY (bidir, harness PHY_HARNESS)

### Harnesses
PHY_HARNESS: RMII-MDIO, RMII-MDC, PHY_RESET, RMII-INT, GPIO59_RMII-TxD1, GPIO58_RMII-TxD0, GPIO60_RMII-TxEN, RMII-RFECLK, GPIO63_RMII-RxERR, GPIO62_RMII-CRSDV, RMII-RxD0, RMII-RxD1

### Nets
+3V3: C25.1 C39.1 C40.1 C69.1 R16.1 R17.1 R22.1 R23.1 R130.2 R131.2 R132.1 R133.2 R135.2 R146.2 R152.2 R155.2 R159.2 R160.2 R164.2 R165.2 R166.2 R168.2 R172.2 U1.17(VDDIO) U5.5(VCC) U8.5(VCC)
Chassis-GND: C50.2 R137.2 T1.Shell(Shield)
GND: C11.2 C12.2 C15.2 C23.2 C25.2 C26.1 C27.1 C39.2 C40.2 C42.2 C50.1 C52.2 C54.2 C55.2 C62.1 C69.2 D17.2 R137.1 R150.2 R156.2 R157.2 R158.2 R161.2 R162.2 R163.2 R167.2 R169.2 R170.2 R171.2 R173.2 T1.10(GND) U1.1(GND) U1.33(EP) U5.3(GND) U8.3(GND)
CRSDV: R140.1 ; port PHY.GPIO62_RMII-CRSDV
ENET_B-CAST-OFF: R172.1 TP23.1 U1.19(RXC/B-CAST_OFF)
ENET_CONFIG0: R161.1 R164.1 U1.28(COL/CONFIG0)
ENET_CONFIG1: R162.1 R165.1 U1.29(CRS/CONFIG1)
ENET_CONFIG2: R140.2 R163.1 R166.1 U1.18(RXDV/CONFIG2)
ENET_DUPLEX: R138.2 R171.1 U1.16(RXD0/DUPLEX)
ENET_ISO: R141.2 R167.1 R168.1 U1.20(RXER/ISO)
ENET_LED0/NWAYEN: R147.1 R169.1 U1.30(LED0/NWAYEN)
ENET_LED1/SPEED: R153.1 R170.1 U1.31(LED1/SPEED)
ENET_NAND_TREE#: R146.1 R149.2 R173.1 U1.21(INTRP/NAND_TREE#)
ENET_PHYAD0: R155.1 R158.1 U1.13(RXD3/PHYAD0)
ENET_PHYAD1: R156.1 R159.1 U1.14(RXD2/PHYAD1)
ENET_PHYAD2: R139.2 R157.1 R160.1 U1.15(RXD1/PHYAD2)
ENET_RX_n: C26.2 D17.3 R23.2 T1.8(RD-) U1.4(RXM)
ENET_RX_p: C27.2 D17.1 R22.2 T1.6(RD+) U1.5(RXP)
ENET_TX_n: C52.1 D17.4 R16.2 T1.5(TD-) U1.6(TXM)
ENET_TX_p: C62.2 D17.6 R17.2 T1.3(TD+) U1.7(TXP)
INT: R149.1 ; port PHY.RMII-INT
LED0_ENET: R148.2 T1.11
LED1_ENET: R154.2 T1.2
MDC: R135.1 U1.12(MDC) ; port PHY.RMII-MDC
MDIO: R133.1 U1.11(MDIO) ; port PHY.RMII-MDIO
RESET: C42.1 R152.1 U1.32(RST#) ; port PHY.PHY_RESET  [project net PHY_RESET]
RFECLK: U1.9(XI) ; port PHY.RMII-RFECLK
RxD0: R138.1 ; port PHY.RMII-RxD0  [project net RMII-RxD0]
RxD1: R139.1 ; port PHY.RMII-RxD1  [project net RMII-RxD1]
RxERR: R141.1 ; port PHY.GPIO63_RMII-RxERR  [project net RMII-RxERR]
TxD0: U1.24(TXD0) ; port PHY.GPIO58_RMII-TxD0  [project net RMII-TxD0]
TxD1: U1.25(TXD1) ; port PHY.GPIO59_RMII-TxD1  [project net RMII-TxD1]
TxEN: U1.23(TXEN) ; port PHY.GPIO60_RMII-TxEN  [project net RMII-TxEN]
NetC11_1: C11.1 C12.1 U1.2(VDD_1.2)
NetC15_1: C15.1 C23.1 F6.2 U1.3(VDDA_3.3)
NetC54_1: C54.1 T1.4(TCT)
NetC55_1: C55.1 T1.7(RCT)
NetF6_1: F6.1 R132.2
NetR130_1: R130.1 T1.1
NetR131_1: R131.1 T1.12
NetR147_2: R147.2 U5.2(A)
NetR148_1: R148.1 U5.4(Y)
NetR150_1: R150.1 U1.10(REXT)
NetR153_2: R153.2 U8.2(A)
NetR154_1: R154.1 U8.4(Y)

Not connected (* = marked no-connect by the designer): D17 5*; T1 9(NC)*; U1 8(XO)* 22(TXC)* 26(TXD2)* 27(TXD3)*; U5 1(N.C)*; U8 1(N.C)*

### Layout directives
differential pair; differential pair class PHY-DIff; net class PHY-DIff: ENET_RX_n, ENET_RX_p, ENET_TX_n, ENET_TX_p

### Notes on the sheet
- Revision:
- Page:

### Library data of the parts
C11 = 120-00042: Cap, Ceramic 2.2uF 6.3V 10% X5R 0402; Manufacturer 1: NIC Components Inc; Manufacturer Part Number 1: NMC0402X5R225K6.3TRPF; Part Name: CAP CER 2.2UF 6.3V 10% X5R 0402; Item Phase: In Production; Tolerance: +/- 10%; Use in new designs: Yes; UBX Code: None; Part Number: 120-00042; Supplier 1: Arrow; Supplier Part Number 1: NMC0402X5R225K6.3TRPF; Manufacturer 2: Cal-Chip Electronics; Manufacturer Part Number 2: GMC04X5R225K6R3NT; Supplier 2: None; Supplier Part Number 2: None; Height: 0.55mm; Max Operating Temp: 85; Min Operating Temp: -55; Pins: 2; Revision: 0D; Temperature Coefficient: X5R; Voltage: 6.3V
C12 C23 C25 C39 C40 C42 = 120-00016: Cap, Ceramic 0.1uF 10V 10% X5R 0402; Manufacturer 1: Murata Electronics North America; Manufacturer Part Number 1: GRM155R61A104KA01J; Part Name: CAP CER 0.1UF 10V 10% X5R 0402; Item Phase: In Production; Tolerance: +/- 10%; Use in new designs: Yes; UBX Code: None; Part Number: 120-00016; Supplier 1: Digi-Key; Supplier Part Number 1: 490-6297-1-ND; Manufacturer 2: Yageo; Manufacturer Part Number 2: CC0402KRX5R6BB104; Supplier 2: Digi-Key; Supplier Part Number 2: 311-1336-1-ND; Height: 0.55mm; Max Operating Temp: 85; Min Operating Temp: -55; Pins: 2; Revision: 0A; Temperature Coefficient: X5R; Voltage: 10V
C15 = UBXH01-0000243: CAP CER X5R 0402 4U7 20% 10V; Manufacturer: Murata Manufacturing Company, Ltd.; Manufacturer P/N: GRM155R61A475MEAA; Editor: martin.pilik; Released by: fabrice.bret-dibat; Env: GREEN; Permitted Use: Volume Products; Perferred: PREF; Mfg P/N Status: Active; Mfg P/N Split: 100; Mfg P/N Released: Yes; Part Number: UBXH01-0000243; Max Operating Temp: 85°C; Min Operating Temp: -40°C; Tolerance: 20%; Max Voltage: 10V; Part Type: Capacitor; Release Data: 2021-05-10T12:57:47; UBX Wiki: https://wiki.u-blox.com/bin/view/Operations/PartDetails?index=24303; RefDes: C; Mfg P/N Datasheet: https://wiki.u-blox.com/bin/view/Generic/Docs/DocumentSummary?index=24302
C26 C27 C52 C54 C55 C62 = UBXH01-0000233: CAP CER X7R 0402 100N 10% 16V; Manufacturer: Murata Manufacturing Company, Ltd.; Manufacturer P/N: GRM155R71C104KA88D; Editor: philippe.largier; Released by: charlotte.biber; Env: ROHS; Permitted Use: Volume Products; Perferred: PREF; Mfg P/N Status: NRND; Mfg P/N Split: 100; Mfg P/N Released: Yes; Part Number: UBXH01-0000233; Tolerance: 10%; Max Voltage: 16V; Min Operating Temp: -55°C; Max Operating Temp: 125°C; Part Type: Capacitor; Release Data: 2016-10-06T14:40:00; UBX Wiki: https://wiki.u-blox.com/bin/view/Operations/PartDetails?index=24094; RefDes: C
C50 = CMP-04427-019248-1: CAP CER 4700PF 2KV X7R 1812; Manufacturer: KYOCERA AVX; Tolerance: 10%; Temperature Coefficient: 30ppm/°C; Capacitance: 4.7nF; Dielectric Material: Ceramic; Width: 0.126inch; Radiation Hardening: No; Mount: Surface Mount; Case/Package: 1812; REACH SVHC: No SVHC; Voltage Rating: 2kV; Voltage Rating (DC): 2kV; Thickness: 0.1inch; Max Operating Temperature: 125°C; Construction: Flat; Height: 2.54mm; Voltage: 2kV; Case Code (Imperial): 1812; Length: 4.5mm; Dielectric: X7R; RoHS Compliant: Yes; Package Quantity: 1000; Min Operating Temperature: -55°C; Case Code (Metric): 4532; Lead Free: Lead Free; Depth: 3.2mm; Packaging: Tape and Reel; Termination: SMD/SMT; Series: 1812; Manufacturer P/N: 1812GC472KAT1A\1K
C69 = UBXH01-0000041: CAP CER X5R 0603 22U 20% 4V; Manufacturer: Taiyo Yuden Company, Ltd.; Manufacturer P/N: AMK107BBJ226MA-T; Editor: pierpaolo.arban; Env: ROHS; Permitted Use: Volume Products; Perferred: PREF; Mfg P/N Status: NRND; Mfg P/N Split: 100; Mfg P/N Released: No; Part Number: UBXH01-0000041; Tolerance: 20%; Max Voltage: 4V; Part Type: Capacitor; UBX Wiki: https://wiki.u-blox.com/bin/view/Operations/PartDetails?index=16911; RefDes: C; Mfg P/N Datasheet: https://wiki.u-blox.com/bin/view/Generic/Docs/DocumentSummary?index=16906
D17 = SRV05-4.TCT: TVS Diode (Uni-directional); Manufacturer_Name: SEMTECH; Datasheet Link: https://datasheet.datasheetarchive.com/originals/distributors/Datasheets-DGA26/1842016.pdf; Height: 1.45mm; Manufacturer_Part_Number: SRV05-4.TCT; Mouser Part Number: 947-SRV05-4.TCT; Mouser Price/Stock: https://www.mouser.co.uk/ProductDetail/Semtech/SRV05-4.TCT?qs=rBWM4%252BvDhIe0tfPjqKjR5Q%3D%3D; Arrow Part Number: SRV05-4.TCT; Arrow Price/Stock: https://www.arrow.com/en/products/srv05-4.tct/semtech?region=nac
F6 = UBXH08-0000000: FERRITE BEAD 0402 120 OHM AT 100MHZ 120OHM 500mA; Manufacturer: TDK Corporation; Manufacturer P/N: MMZ1005S121C; Editor: roland.rust; Permitted Use: Support Products; Mfg P/N Status: Active; Mfg P/N Split: 100; Mfg P/N Released: No; Part Number: UBXH08-0000000; Max Current: 500mA; Min Operating Temp: -40°C; Max Operating Temp: 125°C; Part Type: Ferrite; UBX Wiki: https://wiki.u-blox.com/bin/view/Operations/PartDetails?index=7958; Env: N/A; Perferred: N/A; RefDes: FB; Mfg P/N Datasheet: https://wiki.u-blox.com/bin/view/Generic/Docs/DocumentSummary?index=7940
R16 R17 R22 R23 = UBXH18-0000118: RES THICK FILM CHIP 0603 49R9 1% 100mW; Manufacturer: YAGEO; Manufacturer P/N: RC0603FR-0749R9L; Editor: peter.mueller; Env: ROHS; Permitted Use: Internal Use; Perferred: PREF; Mfg P/N Status: Active; Mfg P/N Split: 100; Mfg P/N Released: No; Part Number: UBXH18-0000118; Tolerance: 1%; Max Power: 100mW; Part Type: Resistor; UBX Wiki: https://wiki.u-blox.com/bin/view/Operations/PartDetails?index=19355; RefDes: R; Min Operating Temp: -55°C; Max Operating Temp: 155°C
R130 R131 = 180-00056: Resistor, 220ohm, 1%, 1/16W, 0402; Manufacturer 1: Rohm Semiconductor; Manufacturer Part Number 1: MCR01MRTF2200; Part Name: RES SMD 220 OHM 1% 1/16W 0402; Item Phase: In Production; Tolerance: +/- 1%; Use in new designs: Yes; Voltage: None; Part Number: 180-00056; Supplier 1: Digi-Key; Supplier Part Number 1: RHM220CDCT-ND; Manufacturer 2: Samsung Electro-Mechanics America, Inc; Manufacturer Part Number 2: RC1005F221CS; Supplier 2: Digi-Key; Supplier Part Number 2: 1276-3963-1-ND; Height: 0.4mm; Max Operating Temp: 155; Min Operating Temp: -55; Pins: 2; Power: 1/16W; Revision: 0A; UBX Code: None
R132 R138-R141 R147-R149 R153 R154 = UBXH18-0003002: as R50 on sheet EVK-IRIS-W1_MOD; Part Number: UBXH18-0003002; Manufacturer 2: YAGEO; Max Power: 100mW; Part Type: Resistor; Release Data: 2012-06-05T09:49:55; UBX Wiki: https://wiki.u-blox.com/bin/view/Operations/PartDetails?index=6611; RefDes: R; Manufacturer P/N 2: 2322_705_91001_L; Mfg P/N Status 2: NRND; Mfg P/N Split 2: 0; Mfg P/N Released 2: Yes
R133 = 180-00110: Resistor, 1.5Kohm, 1%, 1/16W, 0402; Manufacturer 1: Samsung Electro-Mechanics America, Inc; Manufacturer Part Number 1: RC1005F152CS; Part Name: RES SMD 1.5K OHM 1% 1/16W 0402; Item Phase: In Production; Tolerance: +/- 1%; Use in new designs: Yes; Voltage: None; Part Number: 180-00110; Supplier 1: Digi-Key; Supplier Part Number 1: 1276-4030-1-ND; Manufacturer 2: Panasonic Electronic Components; Manufacturer Part Number 2: ERJ-2RKF1501X; Supplier 2: Digi-Key; Supplier Part Number 2: P1.50KLCT-ND; Height: 0.4mm; Max Operating Temp: 155; Min Operating Temp: -55; Pins: 2; Power: 1/16W; Revision: 0A; UBX Code: None
R135 R146 R155-R158 R160-R163 R165-R167 R169-R173 = 180-00021: Resistor 1k ohm 1% 1/16W, 0402; Manufacturer 1: Hong Kong Resistors Manufactory; Manufacturer Part Number 1: RCT021KFLF; Part Name: RES SMD 1K OHM 1% 1/16W 0402; Item Phase: In Production; Tolerance: +/- 1%; Use in new designs: Yes; Voltage: None; Part Number: 180-00021; Supplier 1: None; Supplier Part Number 1: None; Manufacturer 2: Yageo; Manufacturer Part Number 2: RC0402FR-071KL; Supplier 2: Digi-Key; Supplier Part Number 2: 311-1.00KLRCT-ND; Height: 0.4mm; Max Operating Temp: 155; Min Operating Temp: -55; Pins: 2; Power: 1/16W; Revision: 0E; UBX Code: None
R137 = UBXH18-0000460: RES THICK FILM CHIP 1206 100R 0.1% 400mW; Manufacturer: Vishay; Manufacturer P/N: TNPW1206100RBEEA; Editor: jernej.bufon; Released by: mikhail.sialitski; Env: ROHS; Permitted Use: Support Products; Perferred: PREF; Mfg P/N Status: Active; Mfg P/N Split: 100; Mfg P/N Released: Yes; Part Number: UBXH18-0000460; Max Operating Temp: 155°C; Min Operating Temp: -55°C; Tolerance: 0.1%; Max Power: 400mW; Part Type: Resistor; Release Data: 2020-12-07T16:17:04; UBX Wiki: https://wiki.u-blox.com/bin/view/Operations/PartDetails?index=29900; RefDes: R; Mfg P/N Datasheet: https://wiki.u-blox.com/bin/view/Generic/Docs/DocumentSummary?index=29902
R150 = 180-00205: RES 6.49K OHM 1% 1/16W 0402; Manufacturer 1: Stackpole Electronics Inc; Manufacturer Part Number 1: RMCF0402FT6K49; Item Phase: In Production; Tolerance: +/- 1%; Use in new designs: Yes; Voltage: None; Part Number: 180-00205; Supplier 1: Digi-Key; Supplier Part Number 1: RMCF0402FT6K49CT-ND; Manufacturer 2: None; Manufacturer Part Number 2: None; Supplier 2: None; Supplier Part Number 2: None; Height: 0.4mm; Max Operating Temp: 155; Min Operating Temp: -55; Part Name: RES 6.49K OHM 1% 1/16W 0402; Pins: 2; Power: 1/16W; Revision: 0A; UBX Code: None
R152 = 180-00024: as R123 on sheet EVK-IRIS-W1-PowerSchDoc; Part Number: 180-00024; Supplier 1: Digi-Key; Supplier Part Number 1: 1276-3431-1-ND; Manufacturer 2: Hong Kong Resistors Manufactory; Manufacturer Part Number 2: RCT0210KFLF; Supplier 2: None; Supplier Part Number 2: None; Height: 0.4mm; Max Operating Temp: 155; Min Operating Temp: -55; Pins: 2; Power: 1/16W; Revision: 0E; Voltage: N/A
R159 R164 R168 = UBXH18-0000213: RES THICK FILM CHIP 0402 4K7 1% 63mW; Manufacturer: KOA; Manufacturer P/N: RK73H1ETTP4701F; Editor: michael.hein; Released by: vasyl.dykyy; Env: ROHS; Permitted Use: Volume Products; Perferred: PREF; Mfg P/N Status: Active; Mfg P/N Split: 100; Mfg P/N Released: Yes; Part Number: UBXH18-0000213; Tolerance: 1%; Max Power: 63mW; Part Type: Resistor; Release Data: 2015-10-02T11:47:33; Automotive: Yes; UBX Wiki: https://wiki.u-blox.com/bin/view/Operations/PartDetails?index=23300; RefDes: R; Mfg P/N Datasheet: https://wiki.u-blox.com/bin/view/Generic/Docs/DocumentSummary?index=8222
T1 = 74980111211: WE-RJ45 LAN Transformer, 1 Port, 10/100 Base-T, Tab Up; Manufacturer: Wurth Elektronik; LED: yellow-green; Number of Ports: 1; PoE: non-PoE; Shield Tabs: Yes; USB: No USB; Manufacturer Part Number: 74980111211; Category: Filtered Connectors; Match Code: WE-RJ45 LAN; ComponentLink1Description: Website Link; ComponentLink1URL: https://www.we-online.com/redexpert/article/74980111211?ad; ComponentLink2Description: Datasheet Link; ComponentLink2URL: https://www.we-online.com/redexpert/spec/74980111211?ad; Mount: Surface Mount; Operating Temperature Max: 85°C; Operating Temperature Min: -40°C; Packaging: Tape and Reel; Length: 25.4mm; Width: 16.1mm; Height: 13.61mm; Data Rate: 10/100 Base-T; Tab: Up
TP23 = TP10R: Testpoint, Round 1.0mm Dia; Added By: Jeremy D; Part Number: TP10R; Size: 1.0mm; Height: 0; DNP: DNP; Added Date: 2015-02-01; Checked By: Paul B; Checked Date: 2015-02-05
U1 = 220-00037: IC TXRX ETHERNET 32QFN; Manufacturer 1: Microchip Technology; Manufacturer Part Number 1: KSZ8081RNBCA-TR; Part Name: KSZ8081RNBCA; Body Size: 5mmx 5mm; Interface: RMII; Item Phase: In Production; MFG Package: 32-QFN (5x5); SMT Pitch: 0.5mm; Thermal Pad: Yes; Voltage: None; Manufacturer P/N: *; Part Number: 220-00037; Supplier 1: Digi-Key; Supplier Part Number 1: 576-4175-1-ND; Height: 1mm; Max Operating Temp: 70; Min Operating Temp: 0; Pins: 32; Revision: 0A; Use in new designs: Yes; UBX Code: None
U5 U8 = 74LVC1G07GV_SOT753: No Description Available; Mfr_Name: Nexperia; Copyright: Copyright (C) 2023 Ultra Librarian. All rights reserved.; Manufacturer_Part_Number: 74LVC1G07GV_SOT753; RefDes: RefDes; Type: DEV

## Sheet EVK-IRIS-W1-MCULINK-MUX.SchDoc
size A3; DocumentNumber: 6; SheetNumber: 6; SheetTotal: 14
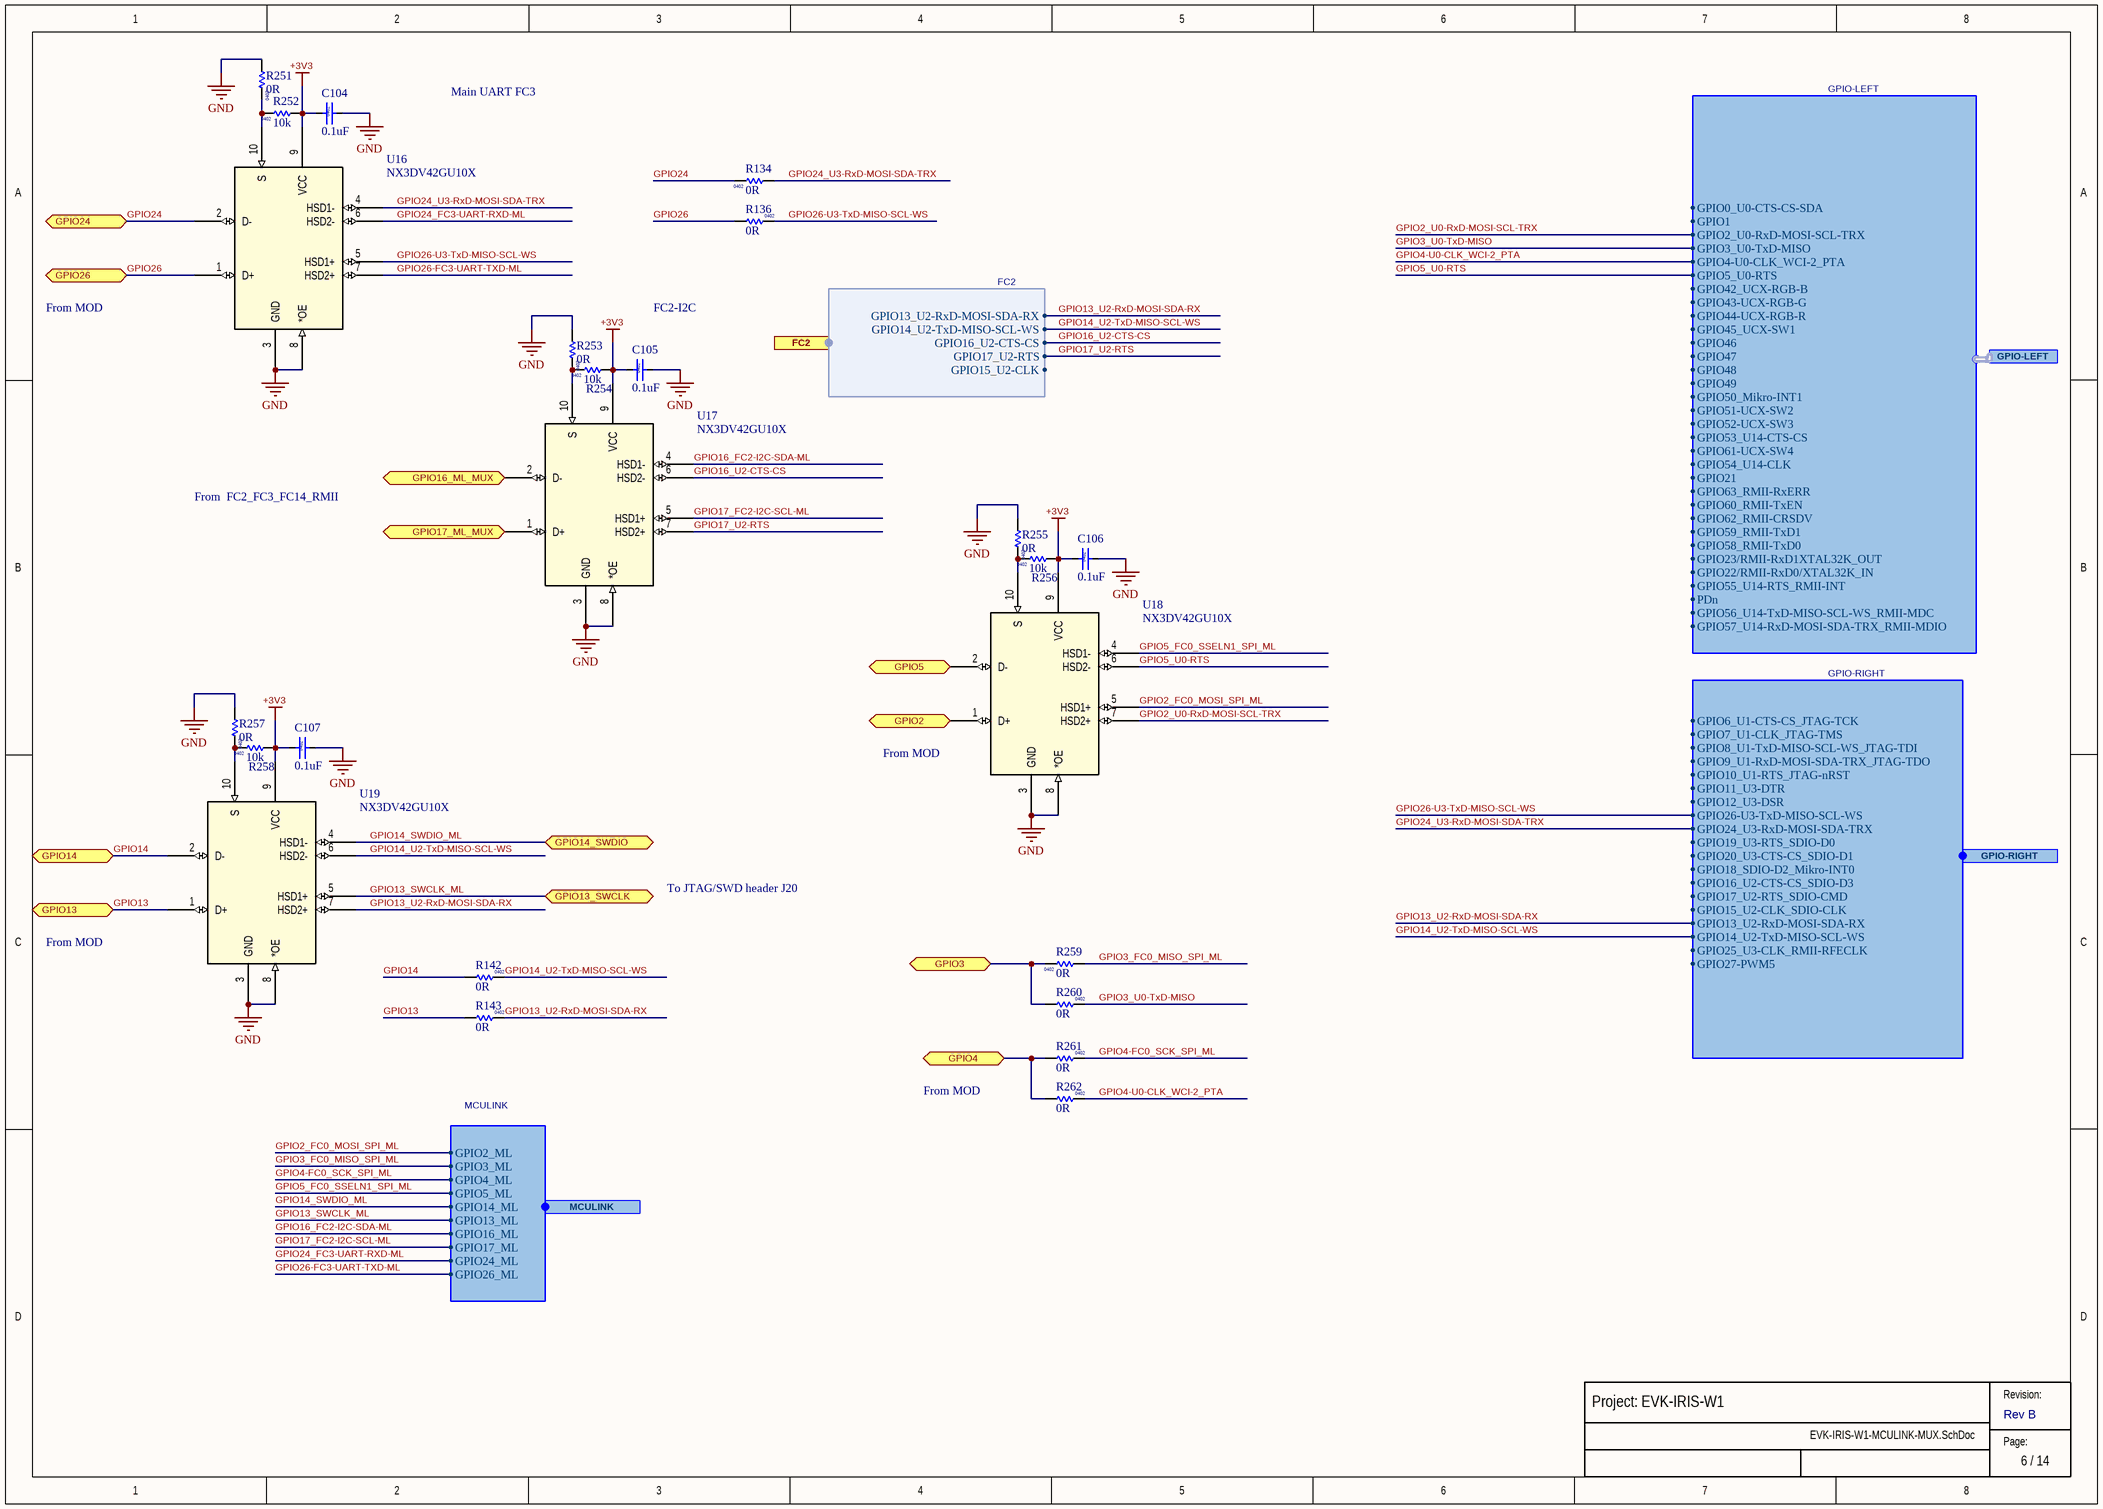
[diagram p9: EVK-IRIS-W1-MCULINK-MUX.SchDoc]

### Parts
C104  value 0.1uF  Size: 0402  [Cap 0402 HD]
C105  value 0.1uF  Size: 0402  [Cap 0402 HD]
C106  value 0.1uF  Size: 0402  [Cap 0402 HD]
C107  value 0.1uF  Size: 0402  [Cap 0402 HD]
R134  value 0R  Size: 0402  [RES 0402 HD]
R136  value 0R  Size: 0402  [RES 0402 HD]
R142  value 0R  Size: 0402  [RES 0402 HD]
R143  value 0R  Size: 0402  [RES 0402 HD]
R251  value 0R  Size: 0402  [RES 0402 HD]
R252  value 10k  Size: 0402  [RES 0402 HD]
R253  value 0R  Size: 0402  [RES 0402 HD]
R254  value 10k  Size: 0402  [RES 0402 HD]
R255  value 0R  Size: 0402  [RES 0402 HD]
R256  value 10k  Size: 0402  [RES 0402 HD]
R257  value 0R  Size: 0402  [RES 0402 HD]
R258  value 10k  Size: 0402  [RES 0402 HD]
R259  value 0R  Size: 0402  [RES 0402 HD]
R260  value 0R  Size: 0402  [RES 0402 HD]
R261  value 0R  Size: 0402  [RES 0402 HD]
R262  value 0R  Size: 0402  [RES 0402 HD]
U16  NX3DV42GU10X  [XQFN10_SOT1337-1_NXP]
U17  NX3DV42GU10X  [XQFN10_SOT1337-1_NXP]
U18  NX3DV42GU10X  [XQFN10_SOT1337-1_NXP]
U19  NX3DV42GU10X  [XQFN10_SOT1337-1_NXP]

### Ports
FC2 (harness FC2), GPIO2 (bidir), GPIO3 (bidir), GPIO4 (bidir), GPIO5 (bidir), GPIO13 (bidir), GPIO13_SWCLK (bidir), GPIO14 (bidir), GPIO14_SWDIO (bidir), GPIO16_ML_MUX (bidir), GPIO17_ML_MUX (bidir), GPIO24 (bidir), GPIO26 (bidir), GPIO-LEFT (harness GPIO-LEFT), GPIO-RIGHT (harness GPIO-RIGHT), MCULINK (harness MCULINK)

### Harnesses
GPIO-RIGHT: GPIO6_U1-CTS-CS_JTAG-TCK, GPIO7_U1-CLK_JTAG-TMS, GPIO8_U1-TxD-MISO-SCL-WS_JTAG-TDI, GPIO9_U1-RxD-MOSI-SDA-TRX_JTAG-TDO, GPIO10_U1-RTS_JTAG-nRST, GPIO11_U3-DTR, GPIO12_U3-DSR, GPIO26-U3-TxD-MISO-SCL-WS, GPIO24_U3-RxD-MOSI-SDA-TRX, GPIO19_U3-RTS_SDIO-D0, GPIO20_U3-CTS-CS_SDIO-D1, GPIO18_SDIO-D2_Mikro-INT0, GPIO16_U2-CTS-CS_SDIO-D3, GPIO17_U2-RTS_SDIO-CMD, GPIO15_U2-CLK_SDIO-CLK, GPIO13_U2-RxD-MOSI-SDA-RX, GPIO14_U2-TxD-MISO-SCL-WS, GPIO25_U3-CLK_RMII-RFECLK, GPIO27-PWM5
GPIO-LEFT: GPIO0_U0-CTS-CS-SDA, GPIO1, GPIO2_U0-RxD-MOSI-SCL-TRX, GPIO3_U0-TxD-MISO, GPIO4-U0-CLK_WCI-2_PTA, GPIO5_U0-RTS, GPIO42_UCX-RGB-B, GPIO43-UCX-RGB-G, GPIO44-UCX-RGB-R, GPIO45_UCX-SW1, GPIO46, GPIO47, GPIO48, GPIO49, GPIO50_Mikro-INT1, GPIO51-UCX-SW2, GPIO52-UCX-SW3, GPIO53_U14-CTS-CS, GPIO61-UCX-SW4, GPIO54_U14-CLK, GPIO21, GPIO63_RMII-RxERR, GPIO60_RMII-TxEN, GPIO62_RMII-CRSDV, GPIO59_RMII-TxD1, GPIO58_RMII-TxD0, GPIO23/RMII-RxD1XTAL32K_OUT, GPIO22/RMII-RxD0/XTAL32K_IN, GPIO55_U14-RTS_RMII-INT, PDn, GPIO56_U14-TxD-MISO-SCL-WS_RMII-MDC, GPIO57_U14-RxD-MOSI-SDA-TRX_RMII-MDIO
MCULINK: GPIO2_ML, GPIO3_ML, GPIO4_ML, GPIO5_ML, GPIO13_ML, GPIO14_ML, GPIO16_ML, GPIO17_ML, GPIO24_ML, GPIO26_ML
FC2: GPIO13_U2-RxD-MOSI-SDA-RX, GPIO14_U2-TxD-MISO-SCL-WS, GPIO16_U2-CTS-CS, GPIO17_U2-RTS, GPIO15_U2-CLK

### Nets
+3V3: C104.1 C105.1 C106.1 C107.1 R252.1 R254.1 R256.1 R258.1 U16.9(VCC) U17.9(VCC) U18.9(VCC) U19.9(VCC)
GND: C104.2 C105.2 C106.2 C107.2 R251.1 R253.1 R255.1 R257.1 U16.3(GND) U16.8(*OE) U17.3(GND) U17.8(*OE) U18.3(GND) U18.8(*OE) U19.3(GND) U19.8(*OE)
GPIO2: U18.1(D+) ; port GPIO2
GPIO2_FC0_MOSI_SPI_ML: U18.5(HSD1+) ; port MCULINK.GPIO2_ML
GPIO2_U0-RxD-MOSI-SCL-TRX: U18.7(HSD2+) ; port GPIO-LEFT.GPIO2_U0-RxD-MOSI-SCL-TRX
GPIO3: R259.2 R260.1 ; port GPIO3
GPIO3_FC0_MISO_SPI_ML: R259.1 ; port MCULINK.GPIO3_ML
GPIO3_U0-TxD-MISO: R260.2 ; port GPIO-LEFT.GPIO3_U0-TxD-MISO
GPIO4: R261.1 R262.1 ; port GPIO4
GPIO4-FC0_SCK_SPI_ML: R261.2 ; port MCULINK.GPIO4_ML
GPIO4-U0-CLK_WCI-2_PTA: R262.2 ; port GPIO-LEFT.GPIO4-U0-CLK_WCI-2_PTA  [project net GPIO4-U0-CLK]
GPIO5: U18.2(D-) ; port GPIO5
GPIO5_FC0_SSELN1_SPI_ML: U18.4(HSD1-) ; port MCULINK.GPIO5_ML
GPIO5_U0-RTS: U18.6(HSD2-) ; port GPIO-LEFT.GPIO5_U0-RTS
GPIO13: R143.1 U19.1(D+) ; port GPIO13
GPIO13_SWCLK_ML: U19.5(HSD1+) ; port GPIO13_SWCLK, port MCULINK.GPIO13_ML
GPIO13_U2-RxD-MOSI-SDA-RX: R143.2 U19.7(HSD2+) ; port GPIO-RIGHT.GPIO13_U2-RxD-MOSI-SDA-RX, port FC2.GPIO13_U2-RxD-MOSI-SDA-RX
GPIO14: R142.1 U19.2(D-) ; port GPIO14
GPIO14_SWDIO_ML: U19.4(HSD1-) ; port GPIO14_SWDIO, port MCULINK.GPIO14_ML
GPIO14_U2-TxD-MISO-SCL-WS: R142.2 U19.6(HSD2-) ; port GPIO-RIGHT.GPIO14_U2-TxD-MISO-SCL-WS, port FC2.GPIO14_U2-TxD-MISO-SCL-WS
GPIO16_FC2-I2C-SDA-ML: U17.4(HSD1-) ; port MCULINK.GPIO16_ML
GPIO16_U2-CTS-CS: U17.6(HSD2-) ; port FC2.GPIO16_U2-CTS-CS
GPIO17_FC2-I2C-SCL-ML: U17.5(HSD1+) ; port MCULINK.GPIO17_ML
GPIO17_U2-RTS: U17.7(HSD2+) ; port FC2.GPIO17_U2-RTS
GPIO24: R134.2 U16.2(D-) ; port GPIO24
GPIO24_FC3-UART-RXD-ML: U16.6(HSD2-) ; port MCULINK.GPIO24_ML
GPIO24_U3-RxD-MOSI-SDA-TRX: R134.1 U16.4(HSD1-) ; port GPIO-RIGHT.GPIO24_U3-RxD-MOSI-SDA-TRX
GPIO26: R136.1 U16.1(D+) ; port GPIO26
GPIO26-FC3-UART-TXD-ML: U16.7(HSD2+) ; port MCULINK.GPIO26_ML
GPIO26-U3-TxD-MISO-SCL-WS: R136.2 U16.5(HSD1+) ; port GPIO-RIGHT.GPIO26-U3-TxD-MISO-SCL-WS
NetJ56_1: U17.2(D-) ; port GPIO16_ML_MUX
NetJ57_1: U17.1(D+) ; port GPIO17_ML_MUX
NetR251_2: R251.2 R252.2 U16.10(S)
NetR253_2: R253.2 R254.2 U17.10(S)
NetR255_2: R255.2 R256.2 U18.10(S)
NetR257_2: R257.2 R258.2 U19.10(S)

### Notes on the sheet
- Main UART FC3
- From MOD
- FC2-I2C
- From  FC2_FC3_FC14_RMII
- To JTAG/SWD header J20
- Revision:
- Page:

### Library data of the parts
C104-C107 = 120-00016: Cap, Ceramic 0.1uF 10V 10% X5R 0402; Manufacturer 1: Murata Electronics North America; Manufacturer Part Number 1: GRM155R61A104KA01J; Part Name: CAP CER 0.1UF 10V 10% X5R 0402; Item Phase: In Production; Tolerance: +/- 10%; Use in new designs: Yes; UBX Code: None; Part Number: 120-00016; Supplier 1: Digi-Key; Supplier Part Number 1: 490-6297-1-ND; Manufacturer 2: Yageo; Manufacturer Part Number 2: CC0402KRX5R6BB104; Supplier 2: Digi-Key; Supplier Part Number 2: 311-1336-1-ND; Height: 0.55mm; Max Operating Temp: 85; Min Operating Temp: -55; Pins: 2; Revision: 0A; Temperature Coefficient: X5R; Voltage: 10V
R134 R136 R142 R143 R251 R253 R255 R257 R259-R262 = UBXH18-0003002: RES THICK FILM CHIP 0402 0R 0 100mW; Manufacturer: KOA; Manufacturer P/N: RK73Z1ETTD; Tolerance: 0; Editor: charlotte.biber; Released by: peter.mueller; Env: ROHS; Permitted Use: Volume Products; Perferred: PREF; Mfg P/N Status: NRND; Mfg P/N Split: 100; Mfg P/N Released: Yes; Part Number: UBXH18-0003002; Manufacturer 2: YAGEO; Max Power: 100mW; Part Type: Resistor; Release Data: 2012-06-05T09:49:55; UBX Wiki: https://wiki.u-blox.com/bin/view/Operations/PartDetails?index=6611; RefDes: R; Manufacturer P/N 2: 2322_705_91001_L; Mfg P/N Status 2: NRND; Mfg P/N Split 2: 0; Mfg P/N Released 2: Yes
R252 R254 R256 R258 = 180-00024: Resistor 10k ohm 1% 1/16W, 0402; Manufacturer 1: Samsung Electro-Mechanics America, Inc; Manufacturer Part Number 1: RC1005F103CS; Part Name: RES SMD 10K OHM 1% 1/16W 0402; Item Phase: In Production; Tolerance: +/- 1%; Use in new designs: Yes; UBX Code: None; Part Number: 180-00024; Supplier 1: Digi-Key; Supplier Part Number 1: 1276-3431-1-ND; Manufacturer 2: Hong Kong Resistors Manufactory; Manufacturer Part Number 2: RCT0210KFLF; Supplier 2: None; Supplier Part Number 2: None; Height: 0.4mm; Max Operating Temp: 155; Min Operating Temp: -55; Pins: 2; Power: 1/16W; Revision: 0E; Voltage: N/A
U16-U19 = NX3DV42GU10X: No Description Available; Mfr_Name: NXP; Copyright: Copyright (C) 2023 Ultra Librarian. All rights reserved.; Manufacturer_Part_Number: NX3DV42GU10X; RefDes: RefDes; Type: DEV